# Altium project QUTMS_MCISO-V01.PrjPcb
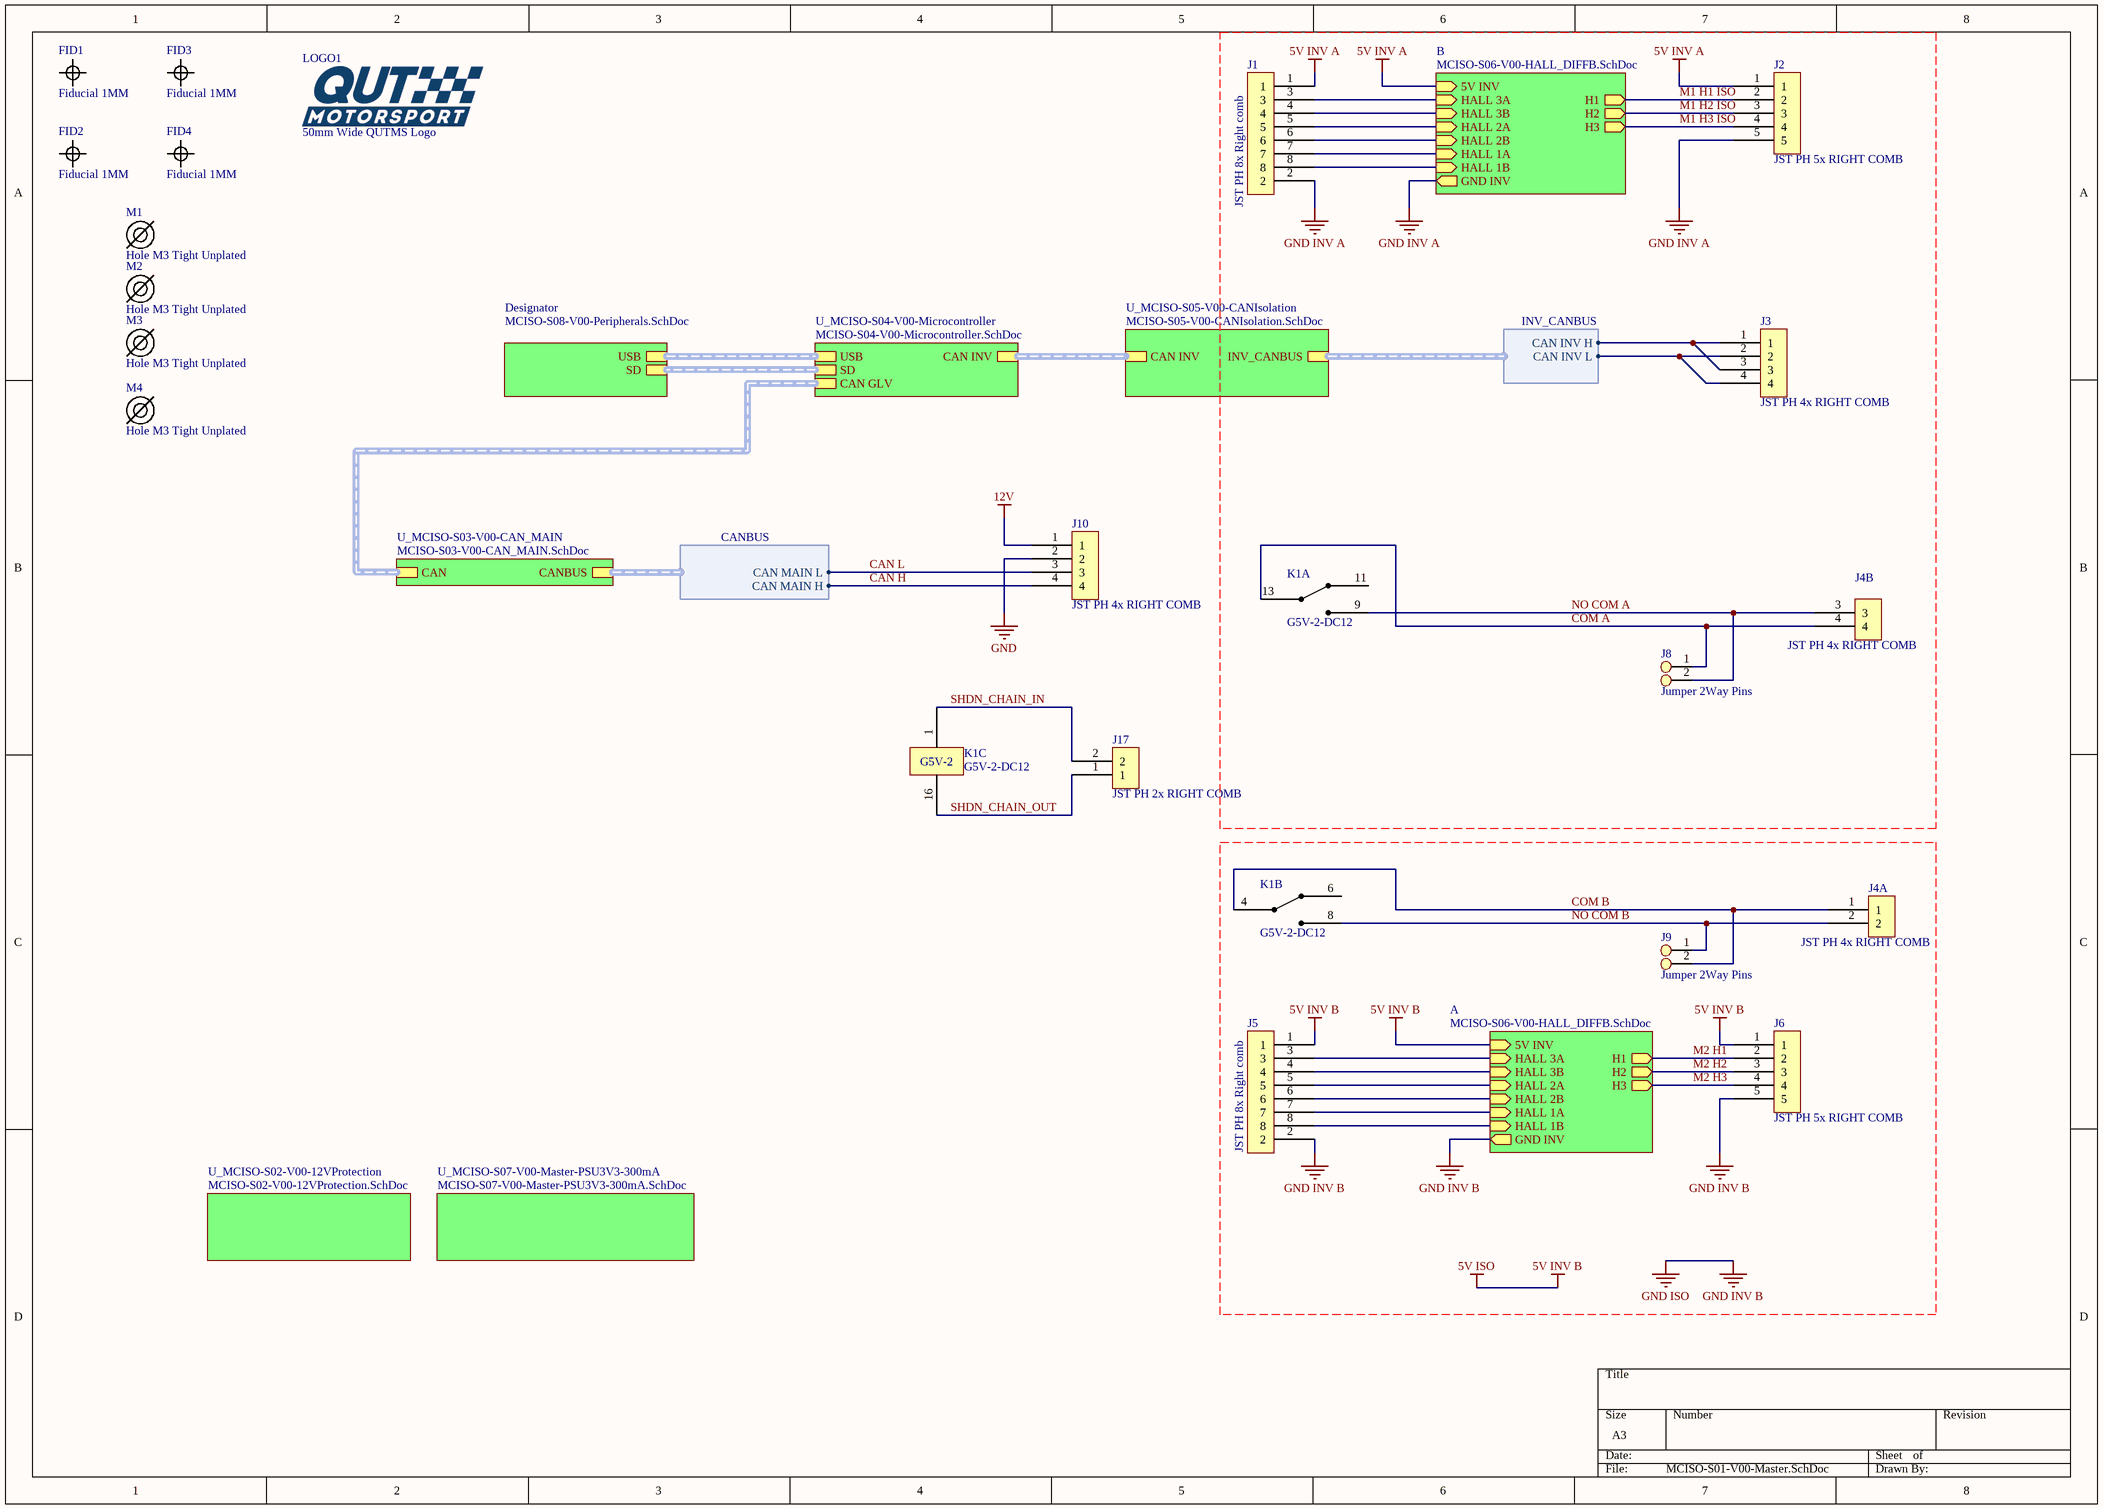
[diagram p0: MCISO-S01-V00-Master.SchDoc]
8 sheets, 124 parts. Net scope: hierarchical (ports join the sheet entries above them; power ports are global).
Board files: MCISO-P01-V05.PcbDoc, MCISO-P01-V06-NewMicro.PcbDoc
Sheets:
  MCISO-S01-V00-Master.SchDoc
    U_MCISO-S04-V00-Microcontroller = MCISO-S04-V00-Microcontroller.SchDoc
    U_MCISO-S05-V00-CANIsolation = MCISO-S05-V00-CANIsolation.SchDoc
    U_MCISO-S02-V00-12VProtection = MCISO-S02-V00-12VProtection.SchDoc
    U_MCISO-S07-V00-Master-PSU3V3-300mA = MCISO-S07-V00-Master-PSU3V3-300mA.SchDoc
    A = MCISO-S06-V00-HALL_DIFFB.SchDoc
    B = MCISO-S06-V00-HALL_DIFFB.SchDoc
    Designator = MCISO-S08-V00-Peripherals.SchDoc
    U_MCISO-S03-V00-CAN_MAIN = MCISO-S03-V00-CAN_MAIN.SchDoc

## Sheet MCISO-S01-V00-Master.SchDoc
size A3; SheetNumber: 1; SheetTotal: 8

### Parts
FID1  Fiducial 1MM  [FIDUCIAL 1MM]  (no BOM)
FID2  Fiducial 1MM  [FIDUCIAL 1MM]  (no BOM)
FID3  Fiducial 1MM  [FIDUCIAL 1MM]  (no BOM)
FID4  Fiducial 1MM  [FIDUCIAL 1MM]  (no BOM)
J1  JST PH 8x Right comb  [JST PH 8x RIGHT SMD]
J2  JST PH 5x RIGHT COMB  [JST PH 5x RIGHT COMB]
J3  JST PH 4x RIGHT COMB  [JST PH 4x RIGHT COMB]
J4  JST PH 4x RIGHT COMB  [JST PH 4x RIGHT COMB]  (parts A,B of 2)
J5  JST PH 8x Right comb  [JST PH 8x RIGHT SMD]
J6  JST PH 5x RIGHT COMB  [JST PH 5x RIGHT COMB]
J8  Jumper 2Way Pins  [Jumper_2Way_Pin]
J9  Jumper 2Way Pins  [Jumper_2Way_Pin]
J10  JST PH 4x RIGHT COMB  [JST PH 4x RIGHT COMB]
J17  JST PH 2x RIGHT COMB  [JST PH 2x RIGHT COMB]
K1  G5V-2-DC12  [G5V-2]  (parts A,B,C of 3)
LOGO1  50mm Wide QUTMS Logo  [QUTMS LOGO 10MM]  (no BOM)
M1  Hole M3 Tight Unplated  [M3.2 UNPLATED]
M2  Hole M3 Tight Unplated  [M3.2 UNPLATED]
M3  Hole M3 Tight Unplated  [M3.2 UNPLATED]
M4  Hole M3 Tight Unplated  [M3.2 UNPLATED]

### Sub-sheets
A = MCISO-S06-V00-HALL_DIFFB.SchDoc: H1 (out), H2 (out), H3 (out), HALL 1A (in), HALL 1B (in), HALL 2A (in), HALL 2B (in), HALL 3A (in), HALL 3B (in), 5V INV (in), GND INV (out)
B = MCISO-S06-V00-HALL_DIFFB.SchDoc: H1 (out), H2 (out), H3 (out), HALL 1A (in), HALL 1B (in), HALL 2A (in), HALL 2B (in), HALL 3A (in), HALL 3B (in), 5V INV (in), GND INV (out)
Designator = MCISO-S08-V00-Peripherals.SchDoc: USB (harness USB), SD (harness SD)
U_MCISO-S02-V00-12VProtection = MCISO-S02-V00-12VProtection.SchDoc: no entries
U_MCISO-S03-V00-CAN_MAIN = MCISO-S03-V00-CAN_MAIN.SchDoc: CANBUS (harness CANBUS), CAN (harness CAN)
U_MCISO-S04-V00-Microcontroller = MCISO-S04-V00-Microcontroller.SchDoc: CAN GLV (harness CAN MAIN), CAN INV (harness CAN INV), USB (harness USB-C), SD (harness SD)
U_MCISO-S05-V00-CANIsolation = MCISO-S05-V00-CANIsolation.SchDoc: INV_CANBUS (harness INV_CANBUS), CAN INV (harness CAN)
U_MCISO-S07-V00-Master-PSU3V3-300mA = MCISO-S07-V00-Master-PSU3V3-300mA.SchDoc: no entries

### Harnesses
INV_CANBUS: CAN INV H, CAN INV L
CANBUS: CAN MAIN H, CAN MAIN L

### Nets
5V INV A: J1.1 J2.1 ; sheet B/5V INV
5V INV B: J5.1 J6.1 ; sheet A/5V INV  [also labelled 5V ISO]
12V: J10.1
GND: J10.2
GND INV A: J1.2 J2.5 ; sheet B/GND INV
GND INV B: J5.2 J6.5 ; sheet A/GND INV  [also labelled GND ISO]
CAN H: J10.4 ; sheet U_MCISO-S03-V00-CAN_MAIN/CANBUS.CAN MAIN H
CAN L: J10.3 ; sheet U_MCISO-S03-V00-CAN_MAIN/CANBUS.CAN MAIN L
COM A: J4.4 J8.1 K1.13
COM B: J4.1 J9.2 K1.4
HALL 1A: J5.7 ; sheet A/HALL 1A
HALL 1A: J1.7 ; sheet B/HALL 1A  [a separate net that carries the same name]
HALL 1B: J5.8 ; sheet A/HALL 1B
HALL 1B: J1.8 ; sheet B/HALL 1B  [a separate net that carries the same name]
HALL 2A: J5.5 ; sheet A/HALL 2A
HALL 2A: J1.5 ; sheet B/HALL 2A  [a separate net that carries the same name]
HALL 2B: J5.6 ; sheet A/HALL 2B
HALL 2B: J1.6 ; sheet B/HALL 2B  [a separate net that carries the same name]
HALL 3A: J5.3 ; sheet A/HALL 3A
HALL 3A: J1.3 ; sheet B/HALL 3A  [a separate net that carries the same name]
HALL 3B: J5.4 ; sheet A/HALL 3B
HALL 3B: J1.4 ; sheet B/HALL 3B  [a separate net that carries the same name]
ISO CAN H: J3.1 J3.3 ; sheet U_MCISO-S05-V00-CANIsolation/INV_CANBUS.CAN INV H
ISO CAN L: J3.2 J3.4 ; sheet U_MCISO-S05-V00-CANIsolation/INV_CANBUS.CAN INV L
M1 H1 ISO: J2.2 ; sheet B/H1  [project net H1]
M1 H2 ISO: J2.3 ; sheet B/H2  [project net H2]
M1 H3 ISO: J2.4 ; sheet B/H3  [project net H3]
M2 H1: J6.2 ; sheet A/H1  [project net H1]
M2 H2: J6.3 ; sheet A/H2  [project net H2]
M2 H3: J6.4 ; sheet A/H3  [project net H3]
NO COM A: J4.3 J8.2 K1.9
NO COM B: J4.2 J9.1 K1.8
SHDN_CHAIN_IN: J17.2 K1.1
SHDN_CHAIN_OUT: J17.1 K1.16

Not connected (* = marked no-connect by the designer): K1 6 11

### Buses and harness runs
harness sheet Designator/SD = sheet U_MCISO-S04-V00-Microcontroller/SD
harness sheet Designator/USB = sheet U_MCISO-S04-V00-Microcontroller/USB
harness sheet U_MCISO-S03-V00-CAN_MAIN/CAN = sheet U_MCISO-S04-V00-Microcontroller/CAN GLV
harness sheet U_MCISO-S04-V00-Microcontroller/CAN INV = sheet U_MCISO-S05-V00-CANIsolation/CAN INV

### Notes on the sheet
- (in symbol G5V-2-DC12, part C) G5V-2

### Library data of the parts
J4 = JST PH 4x RIGHT COMB_1
J8 J9 = Jumper 2Way Side Pins
K1 = G5V-2-DC12: General Purpose Relay DPDT (2 Form C) Through Hole, 12V, 2A
LOGO1 = QUTMS Logo 50mm
M1-M4 = Hole M3 Tight Unplated: M3.2 Hole, No Plating

## Sheet MCISO-S04-V00-Microcontroller.SchDoc: MCISO Microcontroller
size A3; DrawnBy: John Hatfield & Bishwam Pattnaik; DocumentNumber: 4; Revision: 01; SheetNumber: 3; SheetTotal: 8; Version: 01; Project: MCISO QEV3; PageSetup: Record=PageOptions|CenterHorizontal=True|CenterVertical=True|PrintScale=0.97|XCorrection=1.00|YCorrection=1.00|PrintKind=0|BorderSize=5000000|LeftOffset=0|BottomOffset=0|Orientation=2|PaperLength=1000|PaperWidth=1000|Scale=100|PaperSource=7|PrintQuality=-4|MediaType=1|DitherType=10|PaperKind=A4|PrintScaleMode=1
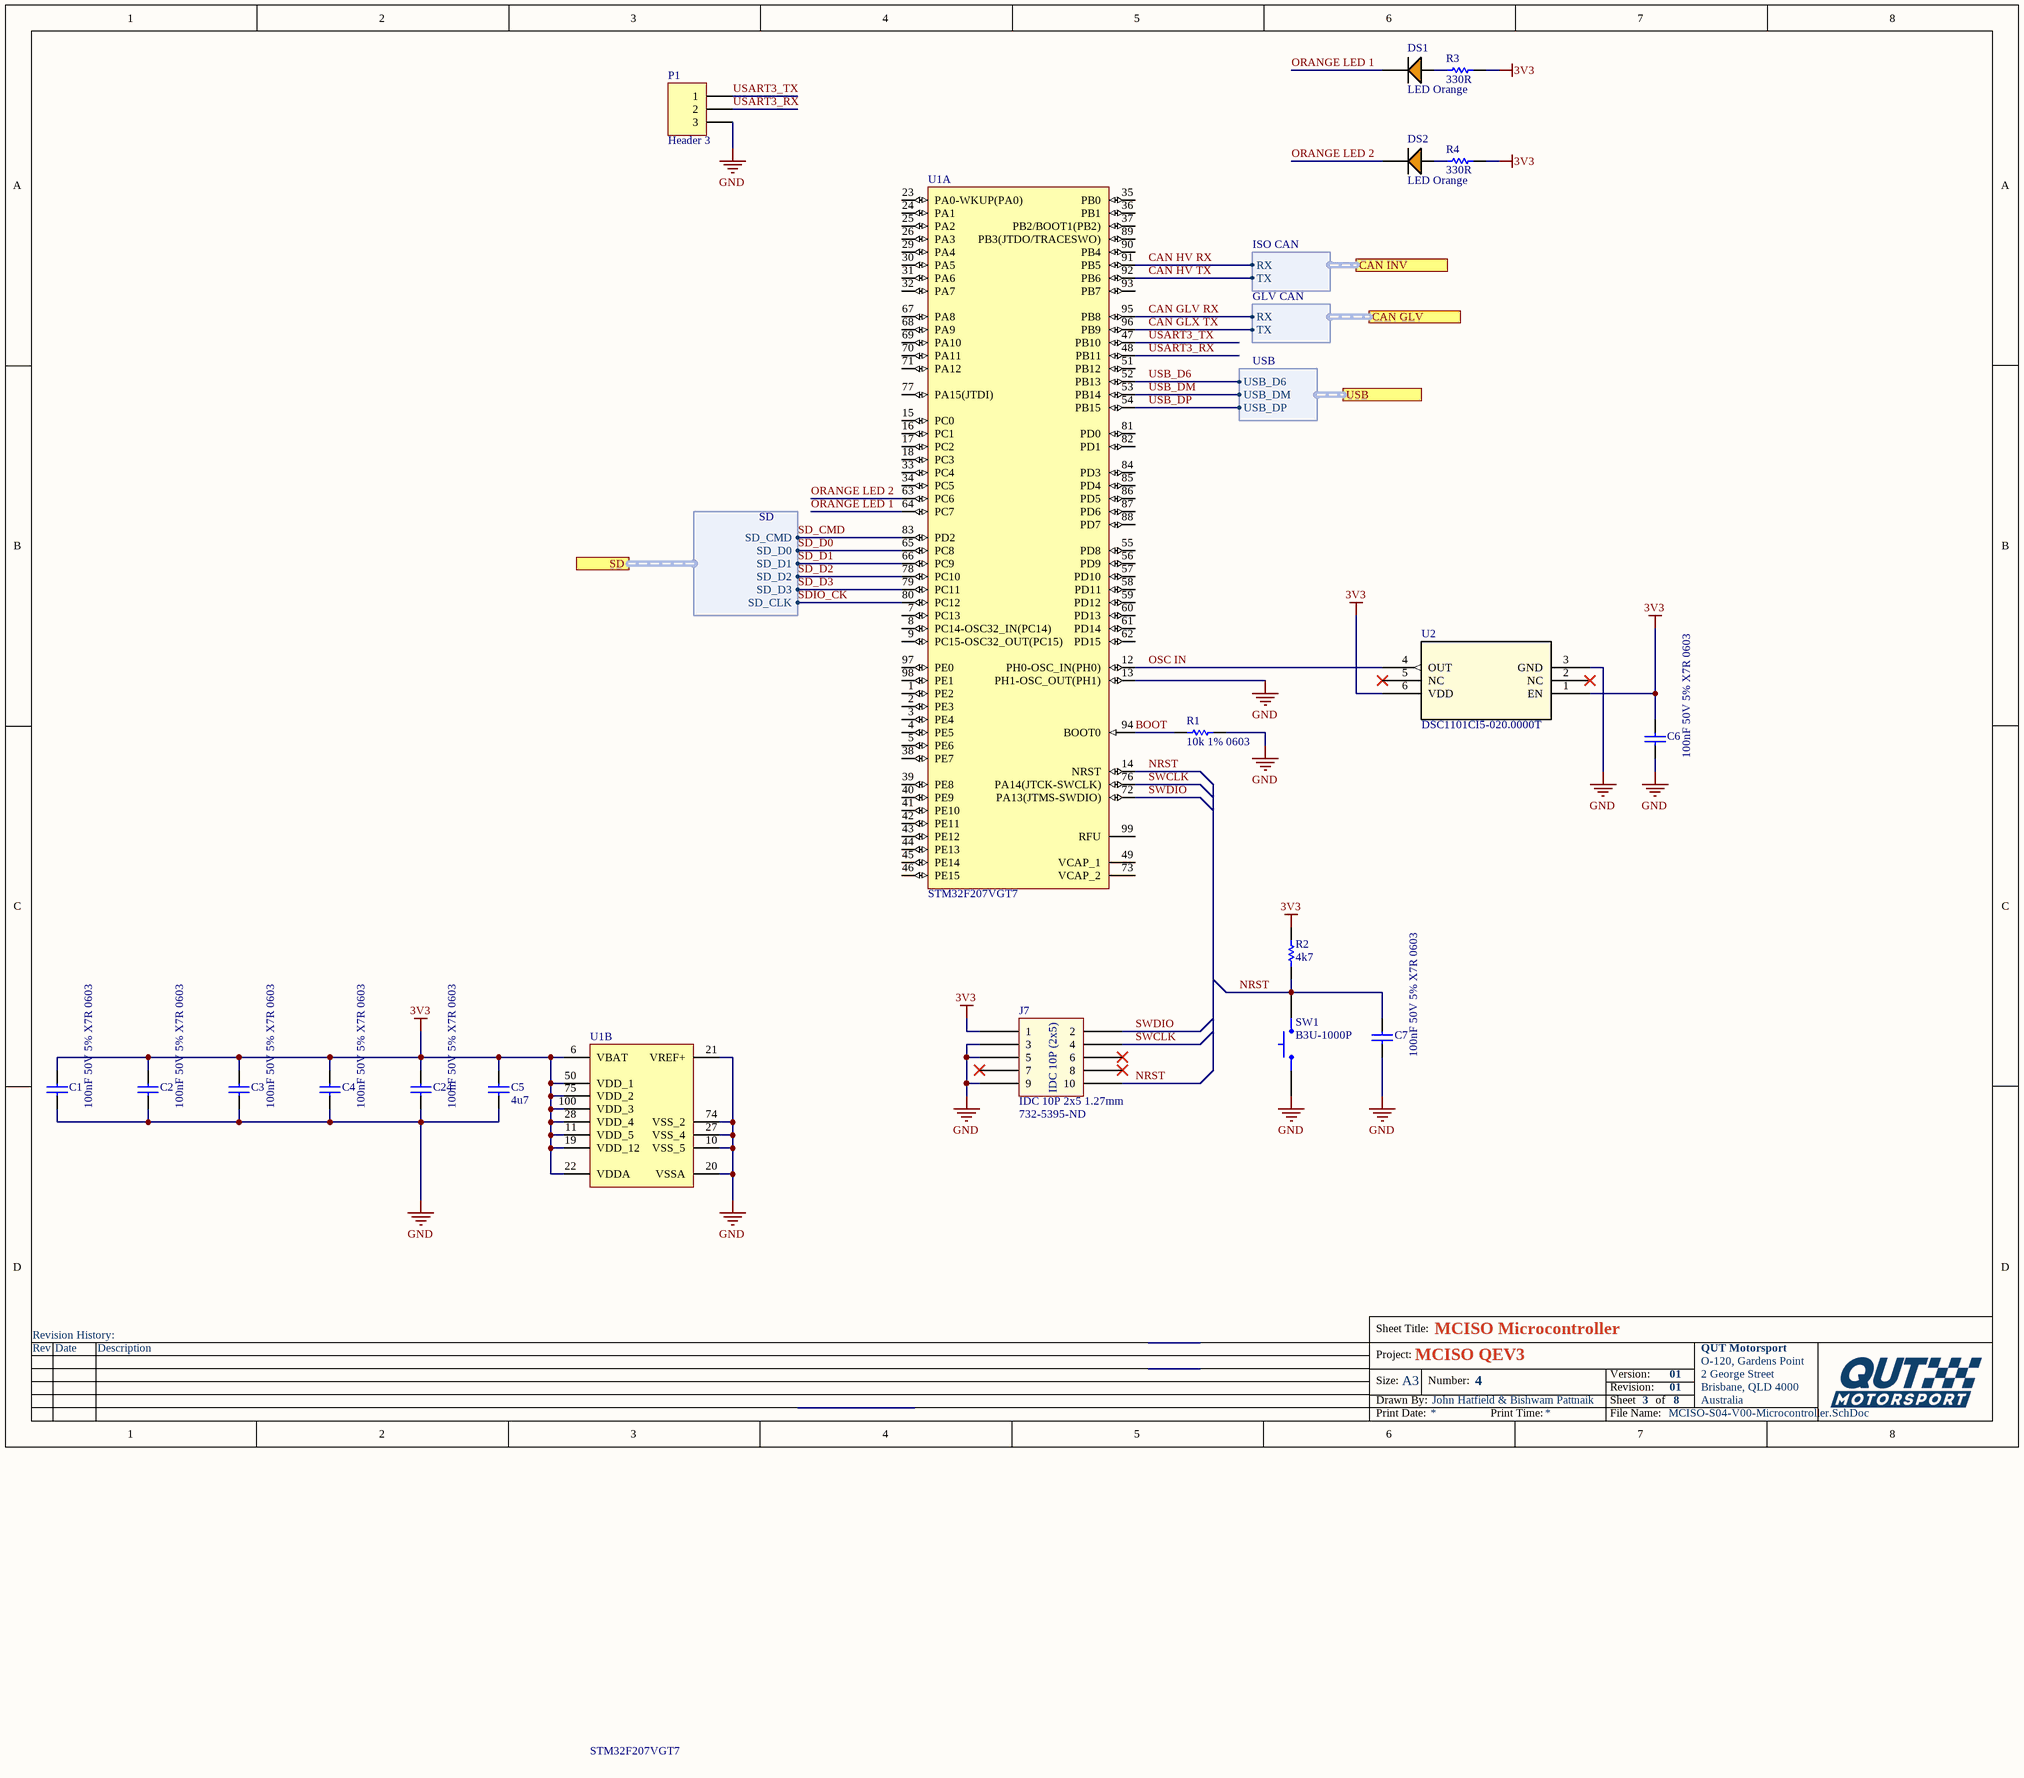
[diagram p1: MCISO-S04-V00-Microcontroller.SchDoc]

### Parts
C1  100nF 50V 5% X7R 0603  [Cap_Ceramic_0603]
C2  100nF 50V 5% X7R 0603  [Cap_Ceramic_0603]
C3  100nF 50V 5% X7R 0603  [Cap_Ceramic_0603]
C4  100nF 50V 5% X7R 0603  [Cap_Ceramic_0603]
C5  4u7  [Cap_Ceramic_0603]
C6  100nF 50V 5% X7R 0603  [Cap_Ceramic_0603]
C7  100nF 50V 5% X7R 0603  [Cap_Ceramic_0603]
C24  100nF 50V 5% X7R 0603  [Cap_Ceramic_0603]
DS1  LED Orange  [LED ORANGE 0603]
DS2  LED Orange  [LED ORANGE 0603]
J7  IDC 10P 2x5 1.27mm  [IDC 1.27MM 10P]
P1  Header 3  [HDR1X3]
R1  10k 1% 0603  [Res_ThinFilm_0603]
R2  4k7  [Res_ThinFilm_0603]
R3  330R  [Res_ThinFilm_0603]
R4  330R  [Res_ThinFilm_0603]
SW1  B3U-1000P  [BTN B3U-1000P]
U1  STM32F207VGT7  [STM-LQFP100_N]  (parts A,B of 2)
U2  DSC1101CI5-020.0000T  [VDFN6_3P2X2P5_MCH]

### Ports
CAN GLV (harness GLV CAN), CAN INV (harness ISO CAN), SD (harness SD), USB (harness USB)

### Harnesses
ISO CAN: TX, RX
GLV CAN: RX, TX
USB: USB_DM, USB_DP, USB_D6
SD: SD_D0, SD_D1, SD_D2, SD_D3, SD_CLK, SD_CMD

### Nets
3V3: C1.2 C2.2 C3.2 C4.2 C5.2 C6.2 C24.2 J7.1 R2.2 R3.2 R4.2 U1.6(VBAT) U1.11(VDD_5) U1.19(VDD_12) U1.22(VDDA) U1.28(VDD_4) U1.50(VDD_1) U1.75(VDD_2) U1.100(VDD_3) U2.1(EN) U2.6(VDD)
GND: C1.1 C2.1 C3.1 C4.1 C5.1 C6.1 C7.1 C24.1 J7.3 J7.5 J7.9 P1.3 R1.2 SW1.1 U1.10(VSS_5) U1.13(PH1-OSC_OUT(PH1)) U1.20(VSSA) U1.21(VREF+) U1.27(VSS_4) U1.74(VSS_2) U2.3(GND)
BOOT: R1.1 U1.94(BOOT0)
CAN GLV RX: U1.95(PB8) ; port CAN GLV.RX
CAN GLX TX: U1.96(PB9) ; port CAN GLV.TX
CAN HV RX: U1.91(PB5) ; port CAN INV.RX
CAN HV TX: U1.92(PB6) ; port CAN INV.TX
NRST: C7.2 J7.10 R2.1 SW1.2 U1.14(NRST)
ORANGE LED 1: DS1.2(C) U1.64(PC7)
ORANGE LED 2: DS2.2(C) U1.63(PC6)
OSC IN: U1.12(PH0-OSC_IN(PH0)) U2.4(OUT)
SD_CMD: U1.83(PD2) ; port SD.SD_CMD
SD_D0: U1.65(PC8) ; port SD.SD_D0
SD_D1: U1.66(PC9) ; port SD.SD_D1
SD_D2: U1.78(PC10) ; port SD.SD_D2
SD_D3: U1.79(PC11) ; port SD.SD_D3
SDIO_CK: U1.80(PC12) ; port SD.SD_CLK
SWCLK: J7.4 U1.76(PA14(JTCK-SWCLK))
SWDIO: J7.2 U1.72(PA13(JTMS-SWDIO))
USART3_RX: P1.2 U1.48(PB11)
USART3_TX: P1.1 U1.47(PB10)
USB_D6: U1.52(PB13) ; port USB.USB_D6
USB_DM: U1.53(PB14) ; port USB.USB_DM  [project net USB DM]
USB_DP: U1.54(PB15) ; port USB.USB_DP  [project net USB DP]
NetDS1_1: DS1.1(A) R3.1
NetDS2_1: DS2.1(A) R4.1

Not connected (* = marked no-connect by the designer): J7 6* 7* 8*; U1 1(PE2) 2(PE3) 3(PE4) 4(PE5) 5(PE6) 7(PC13) 8(PC14-OSC32_IN(PC14)) 9(PC15-OSC32_OUT(PC15)) 15(PC0) 16(PC1) 17(PC2) 18(PC3) 23(PA0-WKUP(PA0)) 24(PA1) 25(PA2) 26(PA3) 29(PA4) 30(PA5) 31(PA6) 32(PA7) 33(PC4) 34(PC5) 35(PB0) 36(PB1) 37(PB2/BOOT1(PB2)) 38(PE7) 39(PE8) 40(PE9) 41(PE10) 42(PE11) 43(PE12) 44(PE13) 45(PE14) 46(PE15) 49(VCAP_1) 51(PB12) 55(PD8) 56(PD9) 57(PD10) 58(PD11) 59(PD12) 60(PD13) 61(PD14) 62(PD15) 67(PA8) 68(PA9) 69(PA10) 70(PA11) 71(PA12) 73(VCAP_2) 77(PA15(JTDI)) 81(PD0) 82(PD1) 84(PD3) 85(PD4) 86(PD5) 87(PD6) 88(PD7) 89(PB3(JTDO/TRACESWO)) 90(PB4) 93(PB7) 97(PE0) 98(PE1) 99(RFU); U2 2(NC)* 5(NC)*

### Notes on the sheet
- (near J7) 732-5395-ND
- Revision History:
- Sheet Title:
- Rev
- Date
- Description
- Project:
- Size:
- Drawn By:
- A3
- Number:
- Revision:
- Sheet
- Version:
- of
- QUT Motorsport
- O-120, Gardens Point
- 2 George Street
- Brisbane, QLD 4000
- Australia
- Print Date:
- Print Time:
- File Name:
- (in symbol IDC 10P 2x5 1.27mm) IDC 10P (2x5)

### Library data of the parts
C1-C4 C6 C7 C24 = 100nF 50V 5% X7R 0603: Capacitor, Ceramic, SMD, 100nF, 50V, 5%, X7R, 0603
C5 = 4u7 50V 5% X7R 0603: Capacitor, Ceramic, SMD, 4u7, 50V, 5%, X7R, 0603
DS1 DS2 = LED ORANGE 0603
P1 = Header 3: Header, 3-Pin; LatestRevisionDate: 17-Jul-2002; LatestRevisionNote: Re-released for DXP Platform.; Publisher: Altium Limited
R1 = 20k 1% 0603: Resistor, SMD, 20k, 0.1W, 5%, 0603
R2 = 4k7 5% 0603: Resistor, SMD, 4k7, 0.1W, 5%, 0603
R3 R4 = 330R 5% 0603: Resistor, SMD, 330R, 0.1W, 5%, 0603
SW1 = BTN B3U-1000P: Omron B3U-1000P Ultra Miniture Switch; ComponentLink1Description: LCSC; ComponentLink1URL: https://lcsc.com/product-detail/Tactile-Switches_BRIGHT-TSA063G50-250_C294565.html
U1 = STM32F207VGT7-Custom: ARM Cortex-M3 32-bit MCU, 1024 KB Flash, 128 KB Internal RAM, 82 I/Os, 100-pin LQFP, -40 to 105 degC, Tray; D/A Converter: 2x12-bit (2 Channel); Internal RAM Size (kB): 128; Supply Voltage(Vcc) min (V): 1.8; I/Os (High Current): 82; Operating Frequency(F) (Processor speed) (MHz): 120; FLASH Size (Prog) (kB): 1024; PartNumber: STM32F207VGT7; DatasheetVersion: Rev. 9; Core: ARM Cortex-M3; ComponentLink3Description: Package Specification; ComponentLink3URL: http://www.st.com/st-web-ui/static/active/en/resource/technical/document/data_brief/DM00071938.pdf; PackageDescription: 100-Pin Low Profile Quad Flat Package, 14 x 14 mm Body, 0.5 mm Pitch; ComponentLink1Description: Manufacturer URL; PackageVersion: Rev. 1, 06/2013; ComponentLink1URL: http://www.st.com/web/en/home.html; PackageReference: LQFP100; ComponentLink2Description: Datasheet; ComponentLink2URL: http://www.st.com/st-web-ui/static/active/en/resource/technical/document/datasheet/CD00237391.pdf; Mounting Technology: Surface Mount; Packing: Tray
U2 = DSC1101CI5-020.0000T: No Description Available; Vendor: Microchip; Built_By: EMA_Jessica; SourceLibrary: Microchip_2019-08-23_23; Manufacturer_Part_Number: DSC1101CI5-020.0000T; Copyright: Copyright (C) 2018 Accelerated Designs. All rights reserved; RefDes: RefDes; Type: DEV

## Sheet MCISO-S05-V00-CANIsolation.SchDoc: Isolated Canbus
size A3; DrawnBy: John Hatfield; SheetNumber: 4; SheetTotal: 8
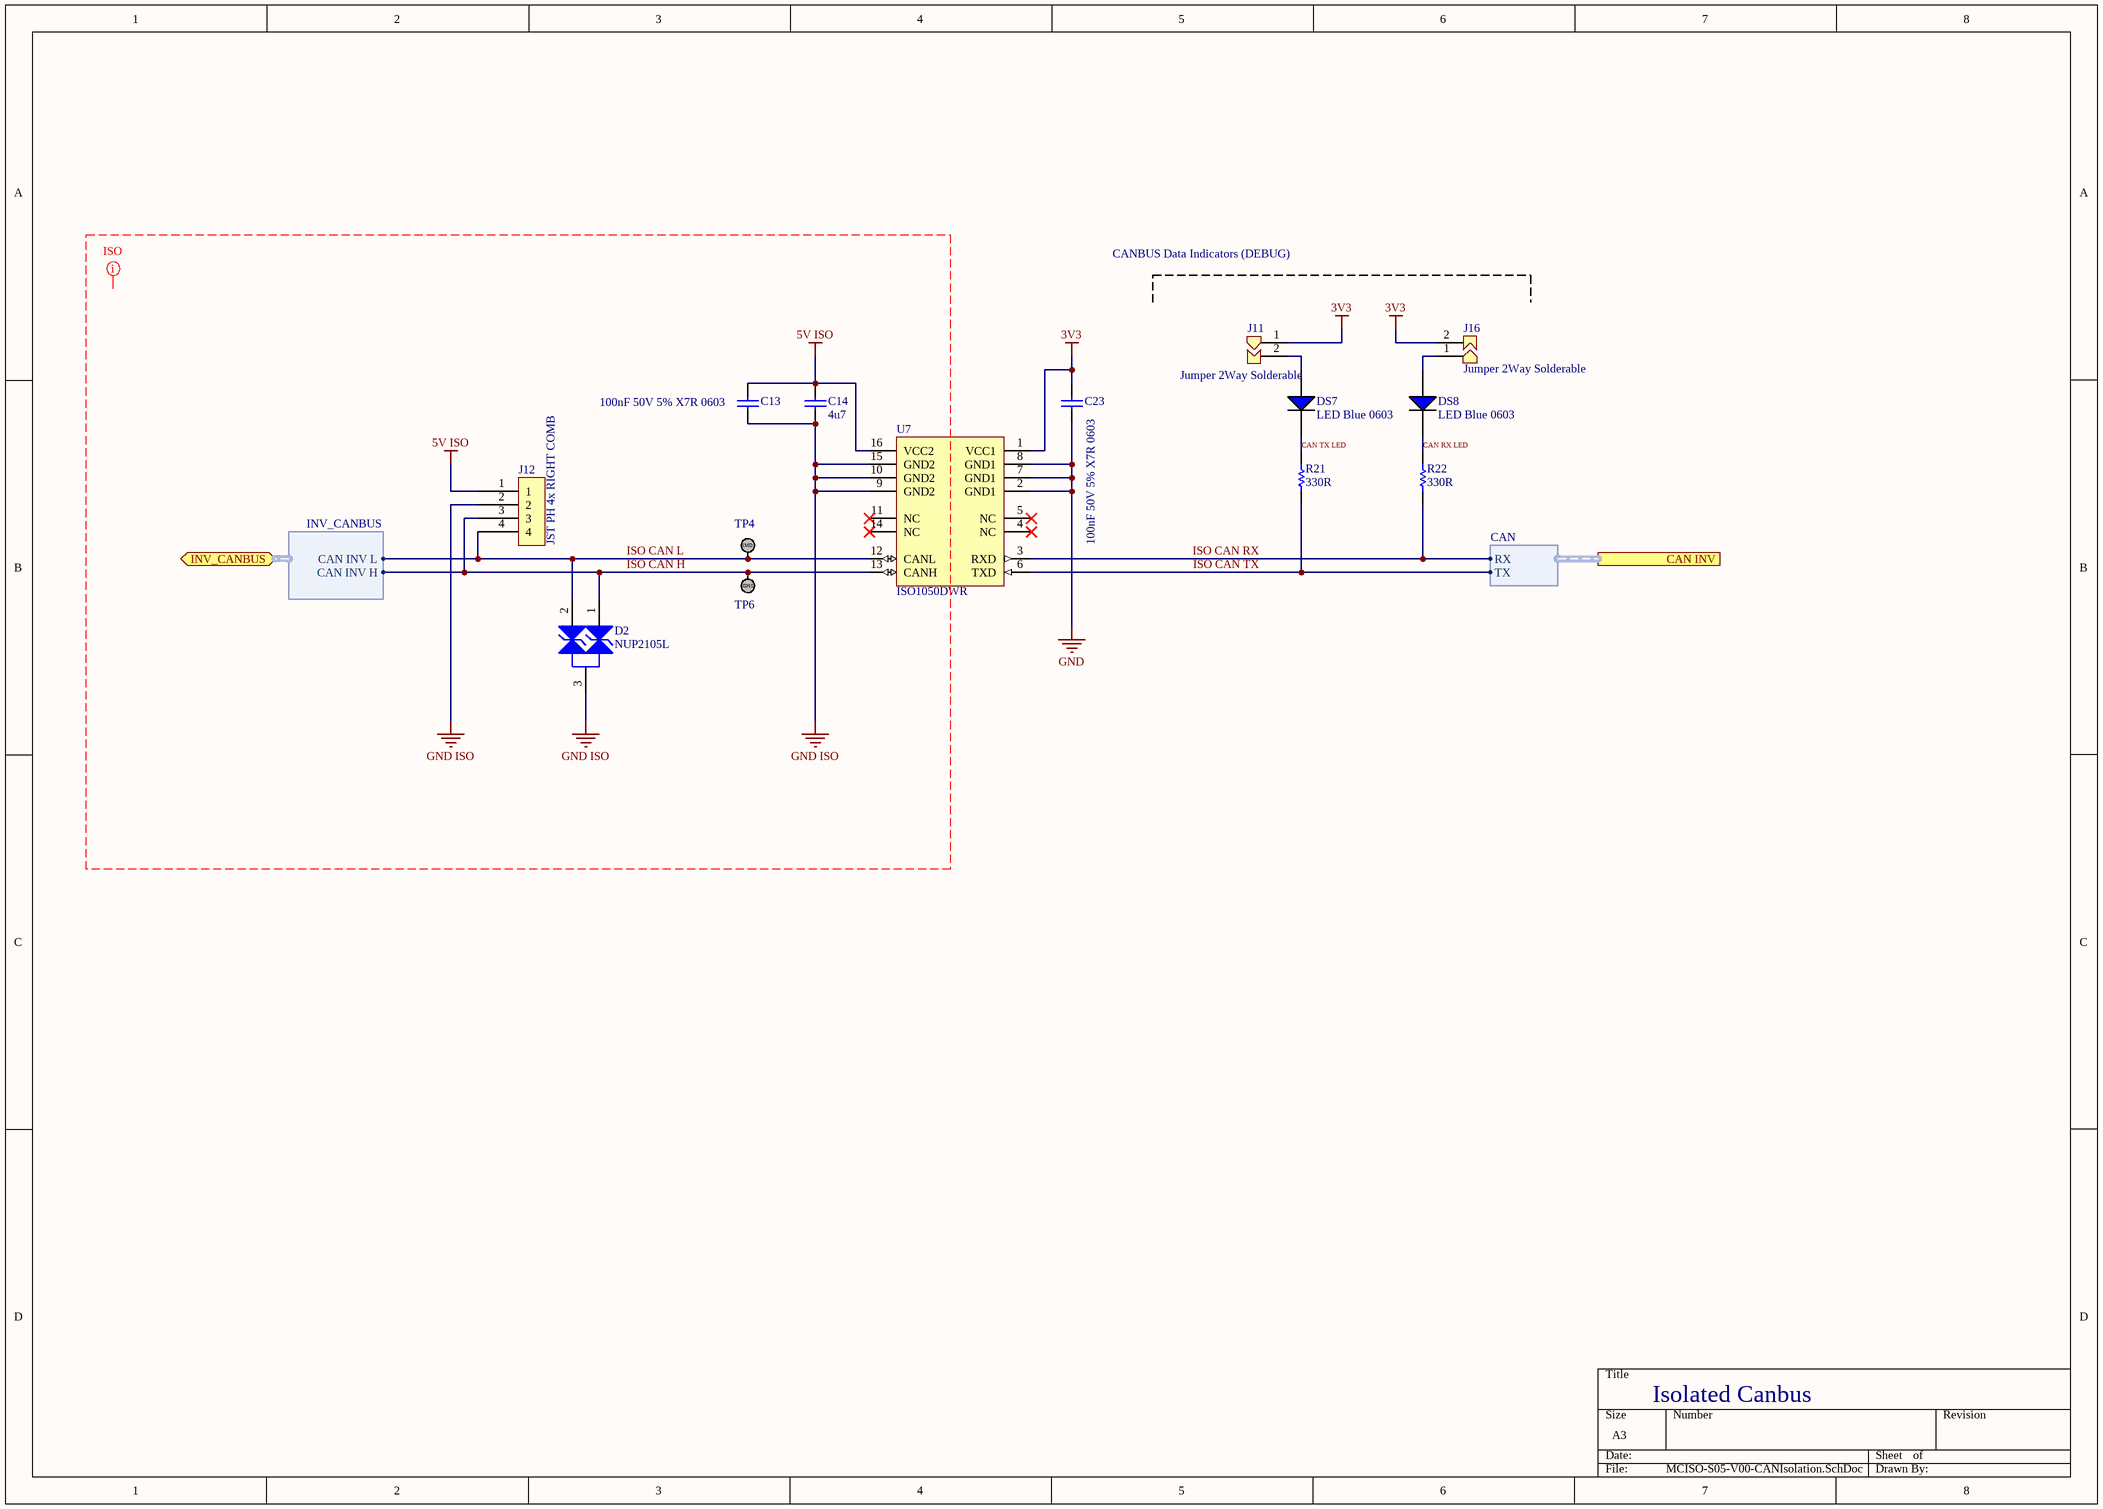
[diagram p2: MCISO-S05-V00-CANIsolation.SchDoc]

### Parts
C13  100nF 50V 5% X7R 0603  [Cap_Ceramic_0603]
C14  4u7  [Cap_Ceramic_0603]
C23  100nF 50V 5% X7R 0603  [Cap_Ceramic_0603]
D2  NUP2105L  [NUP2105L]
DS7  LED Blue 0603  [LED BLUE 0603]
DS8  LED Blue 0603  [LED BLUE 0603]
J11  Jumper 2Way Solderable  [Jumper_2Way_Solderable]
J12  JST PH 4x RIGHT COMB  [JST PH 4x RIGHT COMB]
J16  Jumper 2Way Solderable  [Jumper_2Way_Solderable]
R21  330R  [Res_ThinFilm_0603]
R22  330R  [Res_ThinFilm_0603]
TP4  TestPoint_SMD  [TestPointSMD]  (value not drawn)
TP6  TestPoint_SMD  [TestPointSMD]  (value not drawn)
U7  ISO1050DWR  [DW00016B_V]

### Ports
CAN INV (harness CAN), INV_CANBUS (bidir, harness INV_CANBUS)

### Harnesses
INV_CANBUS: CAN INV L, CAN INV H
CAN: TX, RX

### Nets
3V3: C23.2 J11.1 J16.2 U7.1(VCC1)
5V ISO: C13.2 C14.2 J12.1 U7.16(VCC2)  [project net 5V INV B]
GND: C23.1 U7.2(GND1) U7.7(GND1) U7.8(GND1)
GND ISO: C13.1 C14.1 D2.3 J12.2 U7.9(GND2) U7.10(GND2) U7.15(GND2)  [project net GND INV B]
CAN RX LED: DS8.2(C) R22.2
CAN TX LED: DS7.2(C) R21.2
ISO CAN H: D2.1 J12.3 TP6.1 U7.13(CANH) ; port INV_CANBUS.CAN INV H
ISO CAN L: D2.2 J12.4 TP4.1 U7.12(CANL) ; port INV_CANBUS.CAN INV L
ISO CAN RX: R22.1 U7.3(RXD) ; port CAN INV.RX  [project net CAN HV RX]
ISO CAN TX: R21.1 U7.6(TXD) ; port CAN INV.TX  [project net CAN HV TX]
NetDS7_1: DS7.1(A) J11.2
NetDS8_1: DS8.1(A) J16.1

Not connected (* = marked no-connect by the designer): U7 4(NC)* 5(NC)* 11(NC)* 14(NC)*

### Layout directives
mark named ISO: 5V ISO, GND ISO, ISO CAN H, ISO CAN L

### Notes on the sheet
- CANBUS Data Indicators (DEBUG)
- Isolated Canbus
- (in symbol TestPoint_SMD) SMD

### Library data of the parts
C13 C23 = 100nF 50V 5% X7R 0603: as C1 on sheet MCISO-S04-V00-Microcontroller
C14 = 4u7 50V 5% X7R 0603: as C5 on sheet MCISO-S04-V00-Microcontroller
J11 J16 = Jumper 2Way Side Solderable
J12 = JST PH 4x RIGHT COMB: CAN Ethernet Bridge Port
R21 R22 = 330R 5% 0603: Resistor, SMD, 330R, 0.1W, 5%, 0603
U7 = ISO1050DWR: Isolated CAN Transceiver, -55 to 105 degC, 16-pin SOIC (DW), Green (RoHS & no Sb/Br); Manufacturer: Texas Instruments; Isolated: Yes; Rating: Catalog; Drivers Per Package: 1; ComponentLink1Description: Datasheet; SubFamily: CAN; Mounting Technology: Surface Mount; PackageReference: DW00016B; Code_JEDEC: MS-013-AA; PackageVersion: revG, Jan-2011; ComponentLink2URL: http://www.ti.com/litv/pdf/msoi003g; PartNumber: ISO1050DWR; DatasheetVersion: SLLS983E; Eco-Plan: Green (RoHS & no Sb/Br); ComponentLink1URL: http://www.ti.com/general/docs/lit/getliterature.tsp?genericPartNumber=ISO1050&fileType=pdf; ComponentLink2Description: Package Specification; PackageDescription: 16-Pin Small Outline Integrated Circuit, 10.3 x 7.5 mm, Pitch 1.27 mm Pitch
D2 = NUP2105L: ComponentLink1Description: Datasheet; ComponentLink1URL: https://www.onsemi.cn/PowerSolutions/document/NUP2105L-D.PDF; Parameter 1: *; ComponentLink2Description: LCSC; ComponentLink2URL: https://lcsc.com/product-detail/TVS_ON-Semiconductor-NUP2105LT1G_C14486.html; ComponentLink3Description: Digikey; ComponentLink3URL: https://www.digikey.com.au/product-detail/en/on-semiconductor/SZNUP2105LT1G/SZNUP2105LT1GOSCT-ND/3487669

## Sheet MCISO-S02-V00-12VProtection.SchDoc: 12V Protected Input
size A3; SheetNumber: 2; SheetTotal: 8
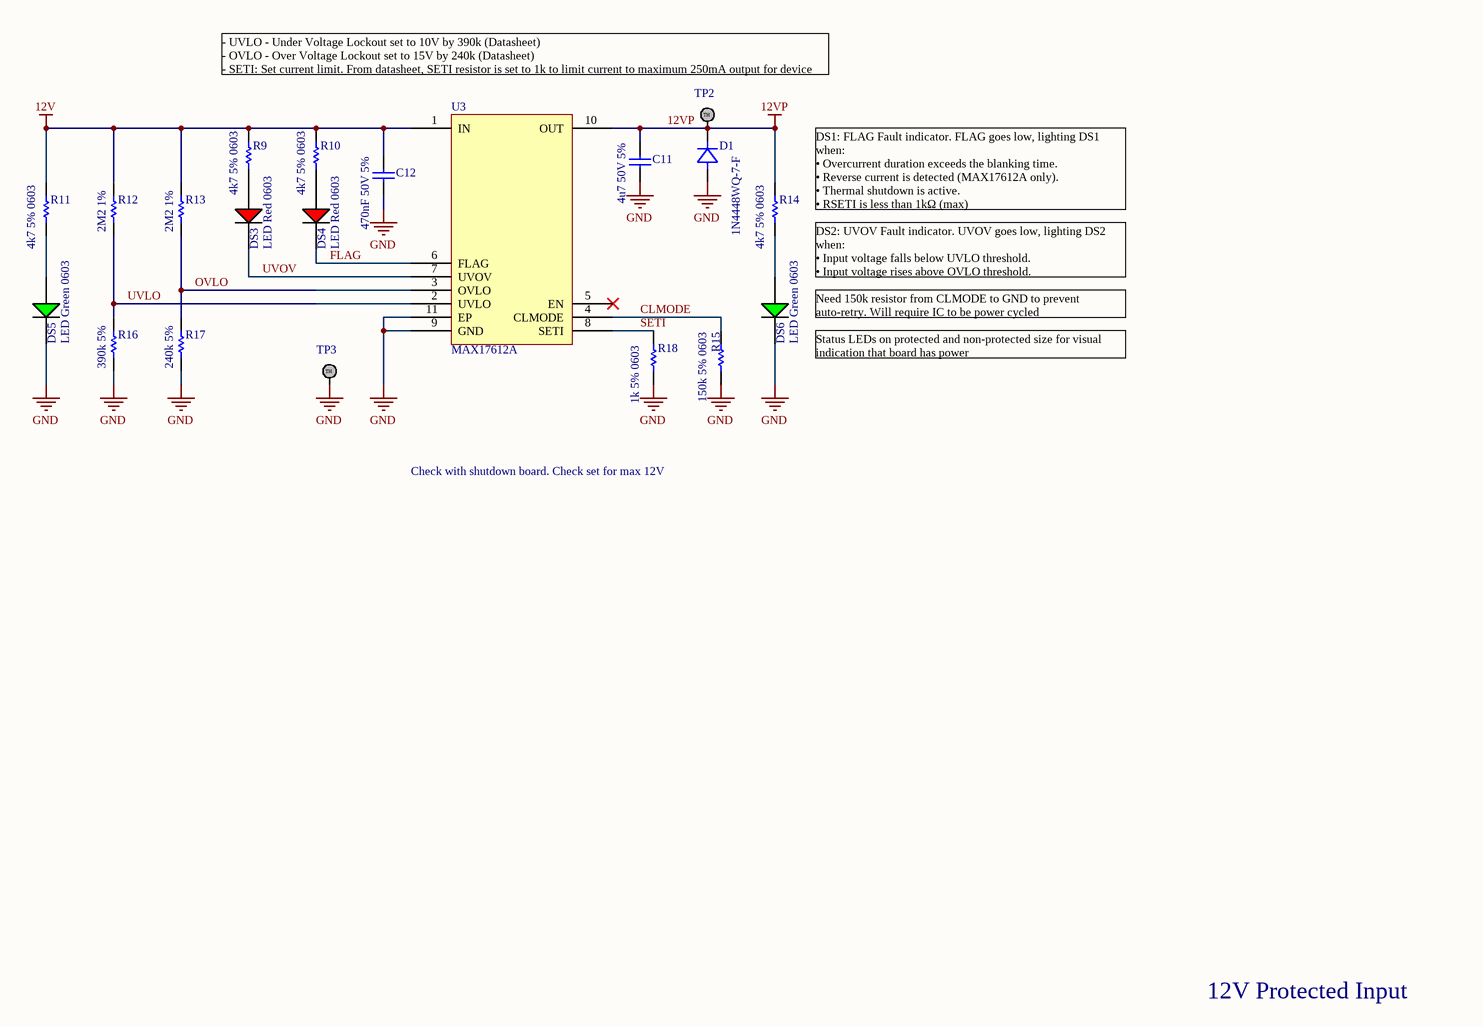
[diagram p3: MCISO-S02-V00-12VProtection.SchDoc]

### Parts
C11  4u7 50V 5%  [Cap_Ceramic_0603]
C12  470nF 50V 5%  [Cap_Ceramic_0603]
D1  1N4448WQ-7-F  [SMA]
DS3  LED Red 0603  [LED RED 0603]
DS4  LED Red 0603  [LED RED 0603]
DS5  LED Green 0603  [LED GREEN 0603]
DS6  LED Green 0603  [LED GREEN 0603]
R9  4k7 5% 0603  [Res_ThinFilm_0603]
R10  4k7 5% 0603  [Res_ThinFilm_0603]
R11  4k7 5% 0603  [Res_ThinFilm_0603]
R12  2M2 1%  [Res_ThinFilm_0603]
R13  2M2 1%  [Res_ThinFilm_0603]
R14  4k7 5% 0603  [Res_ThinFilm_0603]
R15  150k 5% 0603  [Res_ThinFilm_0603]
R16  390k 5%  [Res_ThinFilm_0603]
R17  240k 5%  [Res_ThinFilm_0603]
R18  1k 5% 0603  [Res_ThinFilm_0603]
TP2  TestPoint  [TestPointSMD]  (value not drawn)
TP3  TestPoint  [TestPointSMD]  (value not drawn)
U3  MAX17612A  [MAX17612A]

### Nets
12V: C12.2 R9.2 R10.2 R11.2 R12.2 R13.2 U3.1(IN)
12VP: C11.2 D1.K(Cathode) R14.2 TP2.1 U3.10(OUT)
GND: C11.1 C12.1 D1.A(Anode) DS5.2(C) DS6.2(C) R15.1 R16.1 R17.1 R18.1 TP3.1 U3.9(GND) U3.11(EP)
CLMODE: R15.2 U3.4(CLMODE)
FLAG: DS4.2(C) U3.6(FLAG)
OVLO: R13.1 R17.2 U3.3(OVLO)
SETI: R18.2 U3.8(SETI)
UVLO: R12.1 R16.2 U3.2(UVLO)
UVOV: DS3.2(C) U3.7(UVOV)
NetDS3_1: DS3.1(A) R9.1
NetDS4_1: DS4.1(A) R10.1
NetDS5_1: DS5.1(A) R11.1
NetDS6_1: DS6.1(A) R14.1

Not connected (* = marked no-connect by the designer): U3 5(EN)*

### Notes on the sheet
- - UVLO - Under Voltage Lockout set to 10V by 390k (Datasheet)
  - OVLO - Over Voltage Lockout set to 15V by 240k (Datasheet)
  - SETI: Set current limit. From datasheet, SETI resistor is set to 1k to limit current to maximum 250mA output for device
- (near R14) DS1: FLAG Fault indicator. FLAG goes low, lighting DS1 when:
  • Overcurrent duration exceeds the blanking time.
  • Reverse current is detected (MAX17612A only).
  • Thermal shutdown is active.
  • RSETI is less than 1kΩ (max)
- DS2: UVOV Fault indicator. UVOV goes low, lighting DS2 when:
  • Input voltage falls below UVLO threshold.
  • Input voltage rises above OVLO threshold.
- (near DS6) Need 150k resistor from CLMODE to GND to prevent auto-retry. Will require IC to be power cycled
- (near DS6) Status LEDs on protected and non-protected size for visual indication that board has power
- Check with shutdown board. Check set for max 12V
- 12V Protected Input
- (in symbol TestPoint) TH

### Library data of the parts
C11 = 4u7 50V 5% X7R 0603: as C5 on sheet MCISO-S04-V00-Microcontroller
C12 = 470nF 50V 5% X7R 0603: Capacitor, Ceramic, SMD, 470nF, 50V, 5%, X7R, 0603
D1 = 1N4448WQ-7-F: Diode, SMD, 75V, 5%, 250mA, SOD123; Manufacturer: ON Semiconductor / Fairchild; Manufacturer Part Number: 1N914BWS; Average Rectified Current: 150mA; Element Configuration: Single; Forward Voltage: 1V; Max Reverse Leakage Current: 5uA; Power Dissipation: 200mW; Recovery Time: 4ns; Max Forward Surge Current (Ifsm): 4A; Parameter 1: *; Weight: 0.0276g; Category: Rectifier Diodes; Contact Plating: Tin,Matte; Forward Current: 150mA; Lead Free: Lead Free; Max Operating Temperature: 150°C; Max Repetitive Reverse Voltage (Vrrm): 75V; Max Reverse Voltage (DC): 75V; Min Operating Temperature: -55°C; Mount: Surface Mount; Number of Pins: 2; Package Quantity: 1; Packaging: Tape and Reel; Peak Reverse Current: 5uA; Radiation Hardening: No; REACH SVHC: No SVHC; Reverse Recovery Time: 4ns; Height: 1mm; Length: 1.8mm; Reverse Voltage: 75V; Width: 1.35mm
R9-R11 R14 = 4k7 5% 0603: Resistor, SMD, 4k7, 0.1W, 5%, 0603
R12 R13 = 2M2 1% 0603: Resistor, SMD, 2M2, 0.125W, 1%, 0603
R15 = 150k 5%, 0603: Resistor, SMD, 150k, 0.1W, 5%, 0603
R16 = 390k 5% 0603: Resistor, SMD, 390k, 0.1W, 5%, 0603
R17 = 240k 5% 0603: Resistor, SMD, 240k, 0.1W, 5%, 0603
R18 = 1k 5% 0603: Resistor, SMD, 1k, 0.1W, 5%, 0603
U3 = MAX17612A: 4.5V to 60V, 250mA Current-Limiter with OV, UV, and Reverse Protection; ComponentLink1Description: Datasheet; ComponentLink1URL: https://datasheets.maximintegrated.com/en/ds/MAX17612A-MAX17612C.pdf

## Sheet MCISO-S07-V00-Master-PSU3V3-300mA.SchDoc: Power Supply (20-40V to 3v3 @ 0.1-0.6A)
size A3; DrawnBy: Jonn Dillon; DocumentNumber: 2; Revision: 01; SheetNumber: 5; SheetTotal: 8; Version: 01; Project: AMU 2020 (Sourced from BMS 2020); PageSetup: Record=PageOptions|CenterHorizontal=True|CenterVertical=True|PrintScale=0.97|XCorrection=1.00|YCorrection=1.00|PrintKind=0|BorderSize=5000000|LeftOffset=0|BottomOffset=0|Orientation=2|PaperLength=1000|PaperWidth=1000|Scale=100|PaperSource=7|PrintQuality=-4|MediaType=1|DitherType=10|PaperKind=A4|PrintScaleMode=1
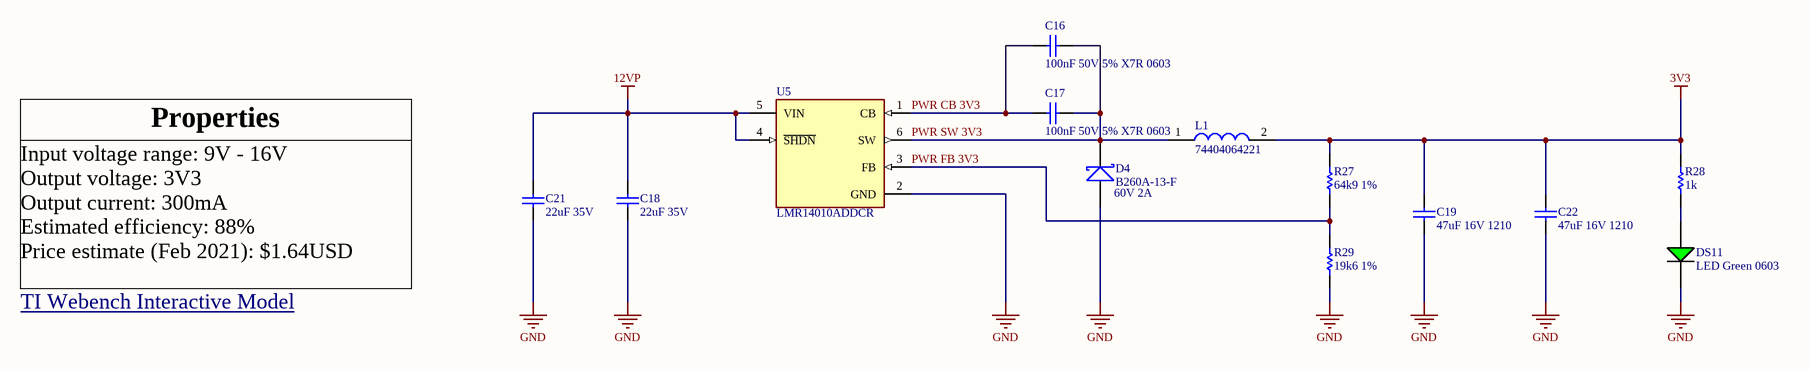
[diagram p4: MCISO-S07-V00-Master-PSU3V3-300mA.SchDoc]

### Parts
C16  100nF 50V 5% X7R 0603  [Cap_Ceramic_0603]
C17  100nF 50V 5% X7R 0603  [Cap_Ceramic_0603]
C18  22uF 35V  [Cap_Ceramic_1206]
C19  47uF 16V 1210  [Cap_Ceramic_1210]
C21  22uF 35V  [Cap_Ceramic_1206]
C22  47uF 16V 1210  [Cap_Ceramic_1210]
D4  B260A-13-F  [SMA]
DS11  LED Green 0603  [LED GREEN 0603]
L1  74404064221  [Inductor_6x6mm]
R27  64k9 1%  [Res_ThinFilm_0603]
R28  1k  [Res_ThinFilm_0603]
R29  19k6 1%  [Res_ThinFilm_0603]
U5  LMR14010ADDCR  [FP-DDC0006A-MFG]

### Nets
3V3: C19.2 C22.2 L1.2 R27.2 R28.2
12VP: C18.1 C21.1 U5.4(~{SHDN}) U5.5(VIN)
GND: C18.2 C19.1 C21.2 C22.1 D4.A DS11.2(C) R29.1 U5.2(GND)
PWR CB 3V3: C16.1 C17.1 U5.1(CB)
PWR FB 3V3: R27.1 R29.2 U5.3(FB)
PWR SW 3V3: C16.2 C17.2 D4.K L1.1 U5.6(SW)
NetDS11_1: DS11.1(A) R28.1

### Notes on the sheet
- Properties
- (near D4) 60V 2A
- Input voltage range: 9V - 16V
  Output voltage: 3V3
  Output current: 300mA
  Estimated efficiency: 88%
  Price estimate (Feb 2021): $1.64USD
- TI Webench Interactive Model <https://webench.ti.com/power-designer/switching-regulator/customize/16?O1I=0.3&O1V=3.3&VinMax=16.0&VinMin=9.0&action=schematic&base_pn=LMR14010A&lang_chosen=en_US&op_TA=30.0&optFactor=3&origin=ODS__LMR14010A>
- Title
- Size:
- Date:
- A3
- Number:
- Time:
- Revision:
- Sheet
- of
- File:

### Library data of the parts
C16 C17 = 100nF 50V 5% X7R 0603: as C1 on sheet MCISO-S04-V00-Microcontroller
C18 C21 = 22uF 35V 20% X5R 1206: 22µF ±20% 35V Ceramic Capacitor X5R 1206 (3216 Metric); ComponentLink1Description: Digikey; ComponentLink1URL: https://www.digikey.com.au/product-detail/en/tdk-corporation/C3216X5R1V226M160AC/445-8045-1-ND/2792165; ComponentLink2Description: Datasheet; ComponentLink2URL: https://product.tdk.com/info/en/catalog/datasheets/mlcc_commercial_general_en.pdf
C19 C22 = 47uF 16V 10% X7R 1210: Capacitor, Ceramic, SMD, 47uF, 16V, 5%, X7R, 1210
D4 = B260A-13-F: Diode, Schottky Barrier Rectifier, 60 V, 2 A, B260A-13-F
L1 = 74404064221: FIXED IND 220UH 660MA 850 MOHM; ComponentLink1Description: Digikey; ComponentLink1URL: https://www.digikey.com.au/product-detail/en/w%C3%BCrth-elektronik/74404064221/732-7261-1-ND/5353241; ComponentLink2Description: LCSC A; ComponentLink2URL: https://lcsc.com/product-detail/Power-Inductors_Sunlord-SWPA6045S221MT_C91047.html; ComponentLink3Description: LCSC B; ComponentLink3URL: https://lcsc.com/product-detail/Power-Inductors_SXN-Shun-Xiang-Nuo-Elec-SMNR6045-221MT_C467145.html
R27 = 64k9 1% 0603: Resistor, SMD, 64k9, 0.1W, 5%, 0603
R28 = 1k 5% 0603: Resistor, SMD, 1k, 0.1W, 5%, 0603
R29 = 19k6 1% 0603: Resistor, SMD, 19k6, 0.1W, 5%, 0603
U5 = CMP-04918-000056-1: IC REG BUCK ADJ 1A TSOT23-6; Manufacturer: Texas Instruments; Max Junction Temp: +125°C; Number Of Outputs: 1; Standoff Height: 0mm; Switching Frequency: 700kHz; Min Supply Voltage: 4V; Max Supply Voltage: 40V; Max Duty Cycle: 96%; Output Type: AdjustableProgrammable; Manufacturer Part Number: LMR14010ADDCR; Temperature: -40°C to +125°C; Output Current: 1A; Category: IC; Temperature Range High: +125°C; Lead Free: Yes; Switching Topology: Buck; Mouser Description: 4-V to 40-V, 1-A Step-Down Converter With High Efficiency Eco-Mode 6-SOT-23-THIN -40 to 125; Device Class L1: Integrated Circuits (ICs); Digikey Description: IC REG BUCK ADJ 1A TSOT23-6; Package: DDC0006A; Ipc Land Pattern Name: SOT95P280X110-6; Device Class L2: Power Management ICs; Temperature Range Low: -40°C; Height: 1.1mm; Device Class L3: Voltage Regulators - Switching; RoHS: TRUE; Automotive: No; Octopart: https://octopart.com/lmr14010addcr-texas+instruments-90753290; ComponentLink2URL: https://www.ti.com/lit/ds/symlink/lmr14010a.pdf; ComponentLink2Description: Datasheet

## Sheet MCISO-S06-V00-HALL_DIFFB.SchDoc
size A4; SheetNumber: 7; SheetTotal: 8
Used 2 times, as channels A, B. Parts and nets are listed once, with the designators drawn on the sheet.
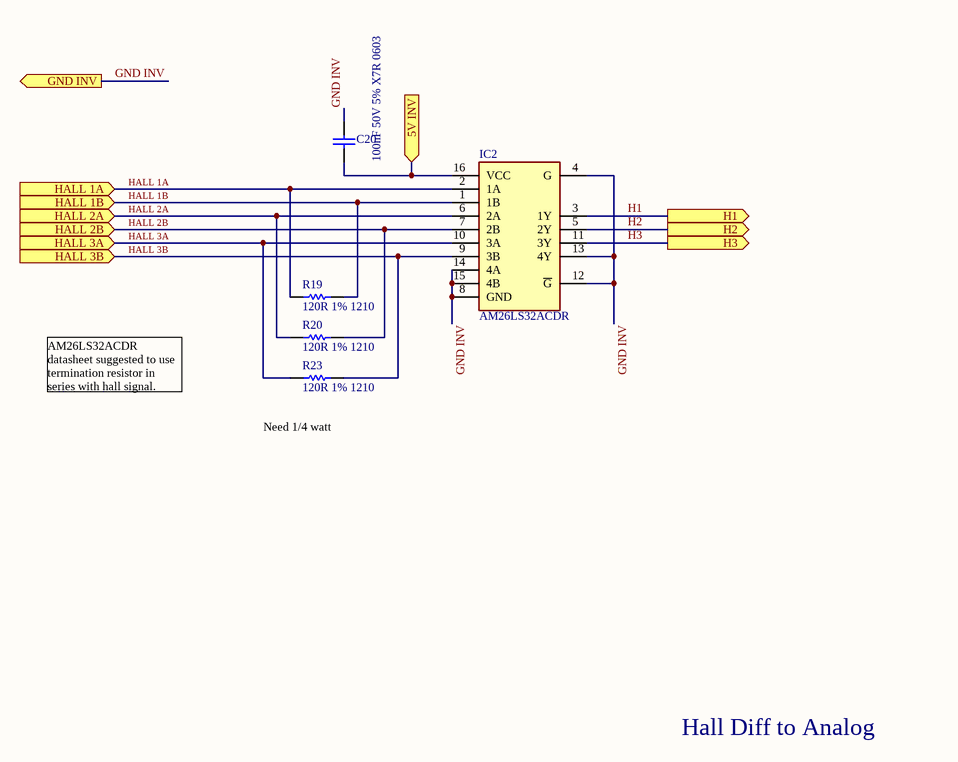
[diagram p5: MCISO-S06-V00-HALL_DIFFB.SchDoc]

### Parts
C20  100nF 50V 5% X7R 0603  [Cap_Ceramic_0603]
IC2  AM26LS32ACDR  [SOIC127P600X175-16N]
R19  120R 1% 1210  [Res_ThinFilm_1210]
R20  120R 1% 1210  [Res_ThinFilm_1210]
R23  120R 1% 1210  [Res_ThinFilm_1210]

### Ports
5V INV (in), GND INV (out), H1 (out), H2 (out), H3 (out), HALL 1A (in), HALL 1B (in), HALL 2A (in), HALL 2B (in), HALL 3A (in), HALL 3B (in)

### Nets
5V INV: C20.1 IC2.16(VCC) ; port 5V INV
GND INV: C20.2 IC2.4(G) IC2.8(GND) IC2.12(~{G}) IC2.13(4Y) IC2.14(4A) IC2.15(4B) ; port GND INV
H1: IC2.3(1Y) ; port H1
H2: IC2.5(2Y) ; port H2
H3: IC2.11(3Y) ; port H3
HALL 1A: IC2.2(1A) R19.1 ; port HALL 1A
HALL 1B: IC2.1(1B) R19.2 ; port HALL 1B
HALL 2A: IC2.6(2A) R20.1 ; port HALL 2A
HALL 2B: IC2.7(2B) R20.2 ; port HALL 2B
HALL 3A: IC2.10(3A) R23.1 ; port HALL 3A
HALL 3B: IC2.9(3B) R23.2 ; port HALL 3B

### Channels
A: designators end in _A; ports 5V INV=5V INV B GND INV=GND INV B H1=H1 H2=H2 H3=H3 HALL 1A=HALL 1A HALL 1B=HALL 1B HALL 2A=HALL 2A HALL 2B=HALL 2B HALL 3A=HALL 3A HALL 3B=HALL 3B
B: designators end in _B; ports 5V INV=5V INV A GND INV=GND INV A H1=H1 H2=H2 H3=H3 HALL 1A=HALL 1A HALL 1B=HALL 1B HALL 2A=HALL 2A HALL 2B=HALL 2B HALL 3A=HALL 3A HALL 3B=HALL 3B

### Notes on the sheet
- AM26LS32ACDR datasheet suggested to use termination resistor in series with hall signal.
- (near R23) Need 1/4 watt
- Hall Diff to Analog

### Library data of the parts
C20 = 100nF 50V 5% X7R 0603: as C1 on sheet MCISO-S04-V00-Microcontroller
IC2 = AM26LS32ACDR: Integrated Circuit; Manufacturer_Name: Texas Instruments; Datasheet Link: http://www.ti.com/lit/gpn/am26ls32ac; Height: 1.75mm; Manufacturer_Part_Number: AM26LS32ACDR; Mouser Part Number: 595-AM26LS32ACDR; Mouser Price/Stock: https://www.mouser.co.uk/ProductDetail/Texas-Instruments/AM26LS32ACDR/?qs=L4Mc90zKIpjEhSPPcfdoEw%3D%3D; Arrow Part Number: AM26LS32ACDR; Arrow Price/Stock: https://www.arrow.com/en/products/am26ls32acdr/texas-instruments
R19 R20 R23 = 120R 1% 1210: Resistor, SMD, 120R, 0.25W, 1%, 1210

## Sheet MCISO-S08-V00-Peripherals.SchDoc: Peripherals
size A3; DrawnBy: John Hatfield; SheetNumber: 8; SheetTotal: 8
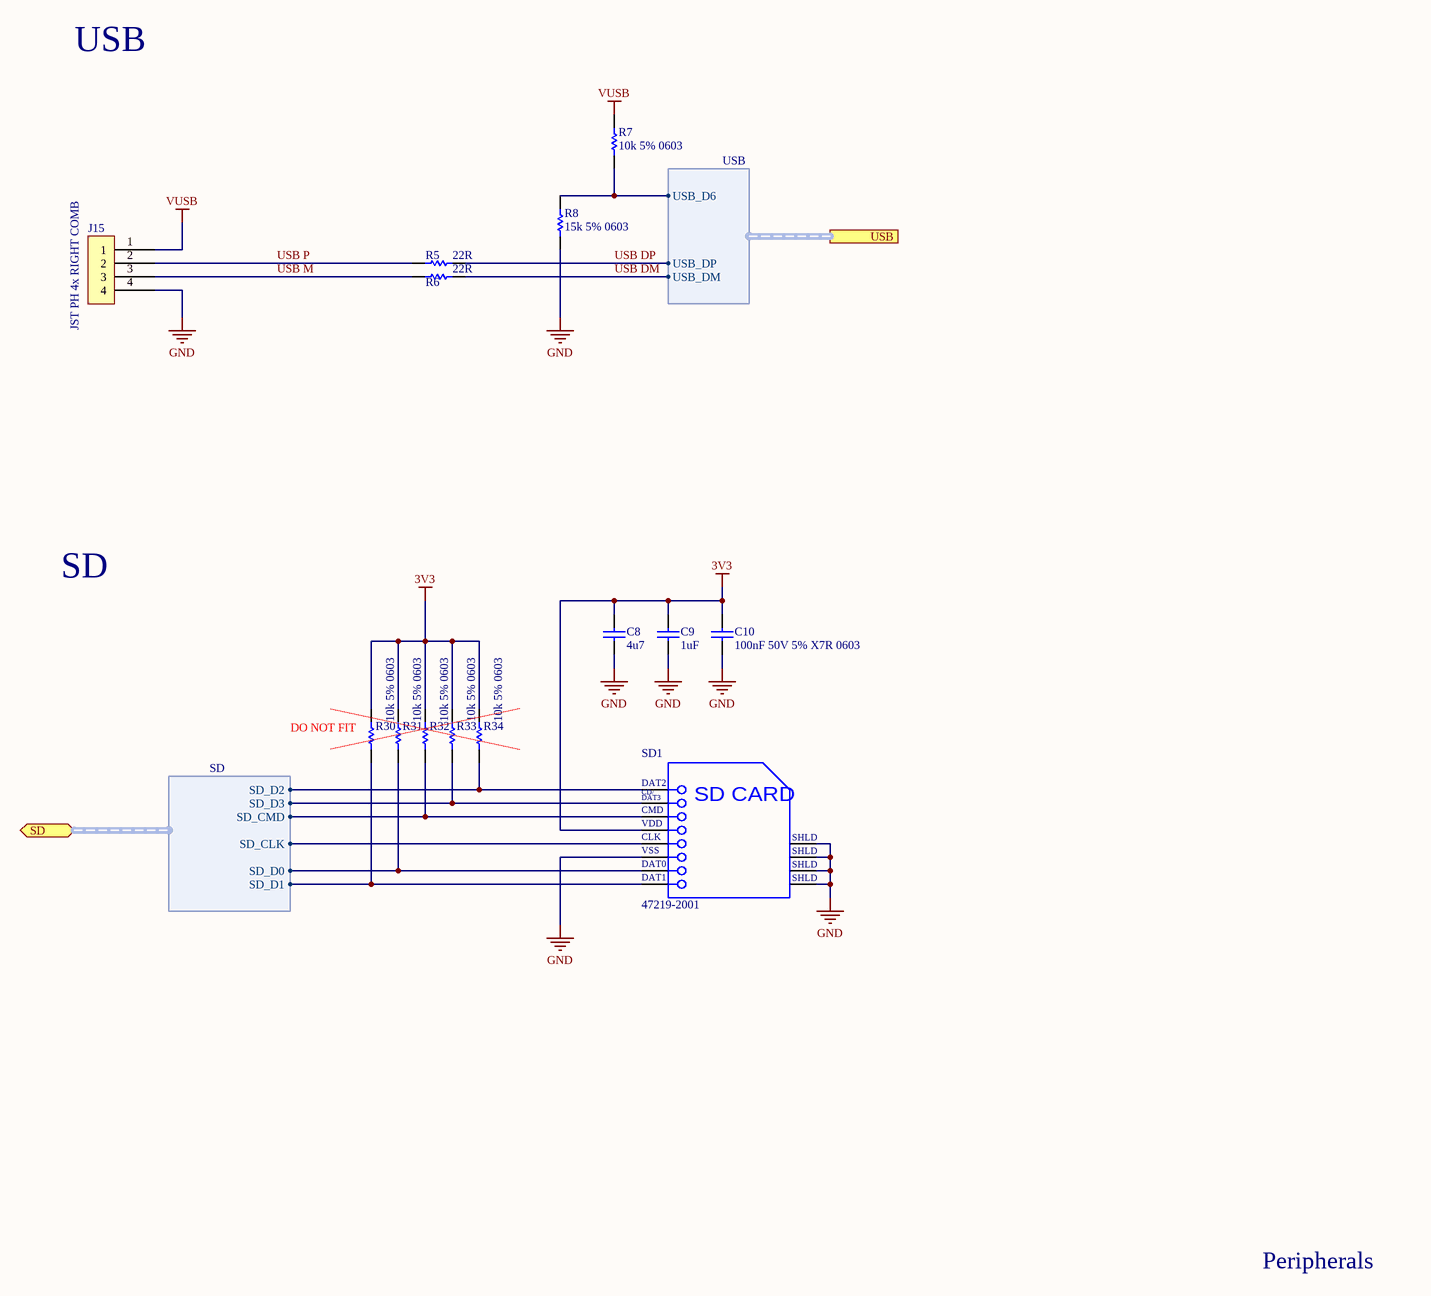
[diagram p6: MCISO-S08-V00-Peripherals.SchDoc]

### Parts
C8  4u7  [Cap_Ceramic_0603]
C9  1uF  [Cap_Ceramic_0603]
C10  100nF 50V 5% X7R 0603  [Cap_Ceramic_0603]
J15  JST PH 4x RIGHT COMB  [JST PH 4x RIGHT COMB]
R5  22R  [Res_ThinFilm_0603]
R6  22R  [Res_ThinFilm_0603]
R7  10k 5% 0603  [Res_ThinFilm_0603]
R8  15k 5% 0603  [Res_ThinFilm_0603]
R30  10k 5% 0603  [Res_ThinFilm_0603]
R31  10k 5% 0603  [Res_ThinFilm_0603]
R32  10k 5% 0603  [Res_ThinFilm_0603]
R33  10k 5% 0603  [Res_ThinFilm_0603]
R34  10k 5% 0603  [Res_ThinFilm_0603]
SD1  47219-2001  [MOLX-47219-2001-8_V]

### Ports
SD (bidir, harness SD), USB (harness USB)

### Harnesses
USB: USB_DP, USB_D6, USB_DM
SD: SD_D2, SD_D3, SD_CMD, SD_CLK, SD_D0, SD_D1

### Nets
3V3: C8.2 C9.2 C10.2 R30.2 R31.2 R32.2 R33.2 R34.2 SD1.4(VDD)
GND: C8.1 C9.1 C10.1 J15.4 R8.1 SD1.6(VSS) SD1.9(SHLD) SD1.10(SHLD) SD1.11(SHLD) SD1.12(SHLD)
VUSB: J15.1 R7.2
SD_CMD: R32.1 SD1.3(CMD) ; port SD.SD_CMD
SD_D0: R31.1 SD1.7(DAT0) ; port SD.SD_D0
SD_D1: R30.1 SD1.8(DAT1) ; port SD.SD_D1
SD_D2: R34.1 SD1.1(DAT2) ; port SD.SD_D2
SD_D3: R33.1 SD1.2(CD/DAT3) ; port SD.SD_D3
SDIO_CK: SD1.5(CLK) ; port SD.SD_CLK
USB DM: R6.2 ; port USB.USB_DM
USB DP: R5.2 ; port USB.USB_DP
USB M: J15.3 R6.1
USB P: J15.2 R5.1
USB_D6: R7.1 R8.2 ; port USB.USB_D6

### Notes on the sheet
- USB
- SD
- (near R30) DO NOT FIT
- Peripherals
- (in symbol CMP-2000-05245-1) CD/; DAT3; SD CARD

### Library data of the parts
C8 = 4u7 50V 5% X7R 0603: as C5 on sheet MCISO-S04-V00-Microcontroller
C9 = 1uF 25V 5% X7R 0603: Capacitor, Ceramic, SMD, 1uF, 25V, 5%, X7R, 0603
C10 = 100nF 50V 5% X7R 0603: as C1 on sheet MCISO-S04-V00-Microcontroller
R5 R6 = 22R 1% 0603: Resistor, SMD, 22R, 0.1W, 1%, 0603
R7 R30-R34 = 10k 5% 0603: Resistor, SMD, 10k, 0.1W, 5%, 0603
R8 = 15k 5% 0603: Resistor, SMD, 15k, 0.1W, 5%, 0603
SD1 = CMP-2000-05245-1: MicroSD Card Connector, Hinge Type, -40 to 85 degC, 8-Pin SMD, RoHS, Tape and Reel; Manufacturer: Molex; Current Rating: 500mA; Number of Contacts: 8; Pitch: 1.09mm; Insertion - Extraction Style: Hinged; Voltage Rating: 100VDC; Product: CardConnectors; Contact Material: CopperAlloy; Series: 47219; Packaging: Reel; Brand: Molex; Product Category: MemoryCardConnectors; Housing Material: Thermoplastic; Mounting Style: SMD/SMT; Termination Style: SMD; Datasheet Version: Rev. F, 06/2009; Card Type: microSD; Manufacturer URL: http://www.molex.com/; RoHS: Details; Datasheet URL: http://www.molex.com/pdm_docs/sd/472192001_sd.pdf; Factory Pack Quantity: 2400

## Sheet MCISO-S03-V00-CAN_MAIN.SchDoc
size A3; SheetNumber: 6; SheetTotal: 8
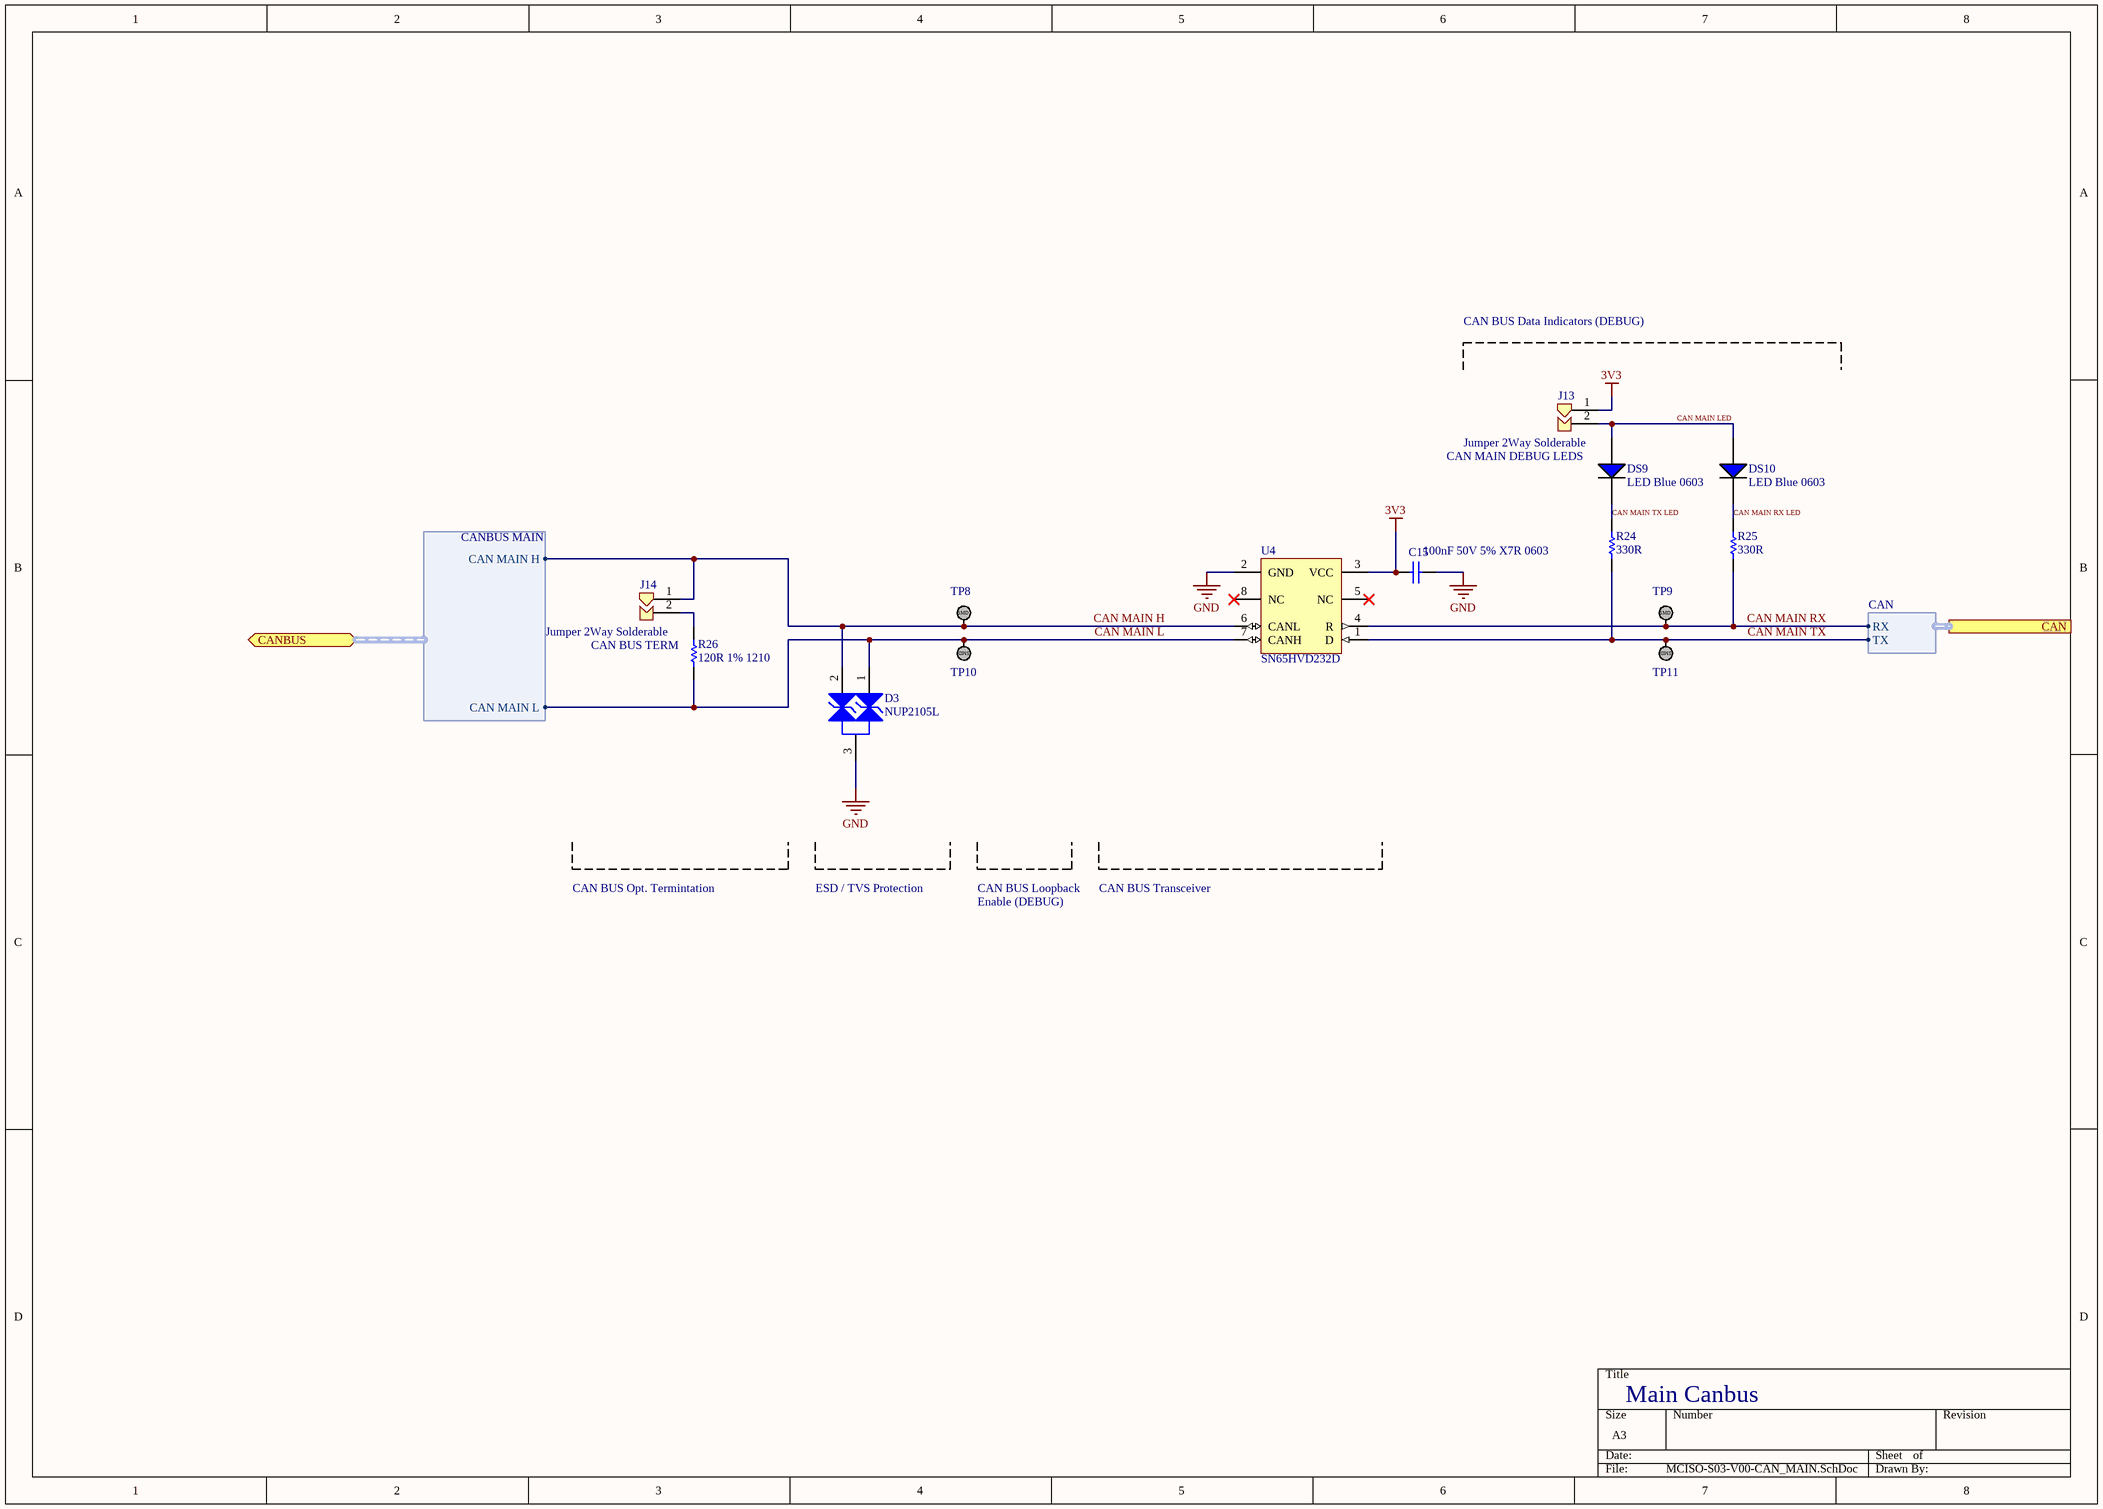
[diagram p7: MCISO-S03-V00-CAN_MAIN.SchDoc]

### Parts
C15  100nF 50V 5% X7R 0603  [Cap_Ceramic_0603]
D3  NUP2105L  [NUP2105L]
DS9  LED Blue 0603  [LED BLUE 0603]
DS10  LED Blue 0603  [LED BLUE 0603]
J13  Jumper 2Way Solderable  [Jumper_2Way_Solderable]
J14  Jumper 2Way Solderable  [Jumper_2Way_Solderable]
R24  330R  [Res_ThinFilm_0603]
R25  330R  [Res_ThinFilm_0603]
R26  120R 1% 1210  [Res_ThinFilm_1210]
TP8  TestPoint_SMD  [TestPointSMD]  (value not drawn)
TP9  TestPoint_SMD  [TestPointSMD]  (value not drawn)
TP10  TestPoint_SMD  [TestPointSMD]  (value not drawn)
TP11  TestPoint_SMD  [TestPointSMD]  (value not drawn)
U4  SN65HVD232D  [D0008A_L]

### Ports
CAN (harness CAN), CANBUS (bidir, harness CANBUS MAIN)

### Harnesses
CANBUS MAIN: CAN MAIN H, CAN MAIN L
CAN: TX, RX

### Nets
3V3: C15.1 J13.1 U4.3(VCC)
GND: C15.2 D3.3 U4.2(GND)
CAN MAIN H: D3.2 J14.1 TP8.1 U4.6(CANL) ; port CANBUS.CAN MAIN H  [project net CAN H]
CAN MAIN L: D3.1 R26.1 TP10.1 U4.7(CANH) ; port CANBUS.CAN MAIN L  [project net CAN L]
CAN MAIN LED: DS9.1(A) DS10.1(A) J13.2
CAN MAIN RX: R25.1 TP9.1 U4.4(R) ; port CAN.RX  [project net CAN GLV RX]
CAN MAIN RX LED: DS10.2(C) R25.2
CAN MAIN TX: R24.1 TP11.1 U4.1(D) ; port CAN.TX  [project net CAN GLX TX]
CAN MAIN TX LED: DS9.2(C) R24.2
NetJ14_2: J14.2 R26.2

Not connected (* = marked no-connect by the designer): U4 5(NC)* 8(NC)*

### Notes on the sheet
- CAN BUS Data Indicators (DEBUG)
- CAN MAIN DEBUG LEDS
- (near R26) CAN BUS TERM
- CAN BUS Opt. Termintation
- ESD / TVS Protection
- CAN BUS Loopback
- Enable (DEBUG)
- CAN BUS Transceiver
- Main Canbus
- (in symbol TestPoint_SMD) SMD

### Library data of the parts
C15 = 100nF 50V 5% X7R 0603: as C1 on sheet MCISO-S04-V00-Microcontroller
J13 J14 = Jumper 2Way Side Solderable
R24 R25 = 330R 5% 0603: Resistor, SMD, 330R, 0.1W, 5%, 0603
R26 = 120R 1% 1210: Resistor, SMD, 120R, 0.25W, 1%, 1210
U4 = CMP-0315-00073-2: 3.3 V CAN Transceiver, 17 mA, -40 to 85 degC, 8-pin SOIC (D), Green (RoHS & no Sb/Br); Manufacturer: Texas Instruments; Supply Voltage(s)(V): 3.3; Transient Pulse Protection(V): -25 to 25; ICC(Max)(mA): 17; Drivers Per Package: 1; Rating: Catalog; Code_JEDEC: MS-012AA; Mounting Technology: Surface Mount; PackageDescription: 8-Pin Plastic Small Outline Integrated Circuit, 4.9 x 3.9 mm, Pitch 1.27 mm Pitch; SubFamily: CAN; PackageVersion: revM, Jun-2011; Isolated: No; DatasheetVersion: SLOS346K; PackageReference: D0008A; Receivers Per Package: 1; Footprint: SN65HVD232; ComponentLink1Description: Datasheet; PartNumber: SN65HVD232D; Eco-Plan: Green (RoHS & no Sb/Br); ComponentLink1URL: http://www.ti.com/general/docs/lit/getliterature.tsp?genericPartNumber=SN65HVD232&fileType=pdf
D3 = NUP2105L: ComponentLink1Description: Datasheet; ComponentLink1URL: https://www.onsemi.cn/PowerSolutions/document/NUP2105L-D.PDF; Parameter 1: *; ComponentLink2Description: LCSC; ComponentLink2URL: https://lcsc.com/product-detail/TVS_ON-Semiconductor-NUP2105LT1G_C14486.html; ComponentLink3Description: Digikey; ComponentLink3URL: https://www.digikey.com.au/product-detail/en/on-semiconductor/SZNUP2105LT1G/SZNUP2105LT1GOSCT-ND/3487669

## Nets that join several sheets
3V3: MCISO-S04-V00-Microcontroller (21 pins), MCISO-S05-V00-CANIsolation (C23.2 J11.1 J16.2 U7.1), MCISO-S07-V00-Master-PSU3V3-300mA (5 pins), MCISO-S08-V00-Peripherals (9 pins), MCISO-S03-V00-CAN_MAIN (C15.1 J13.1 U4.3)
5V INV A: MCISO-S01-V00-Master (J1.1 J2.1), B (C20_B.1 IC2_B.16)
5V INV B: MCISO-S01-V00-Master (J5.1 J6.1), MCISO-S05-V00-CANIsolation (C13.2 C14.2 J12.1 U7.16), A (C20_A.1 IC2_A.16)
12V: MCISO-S01-V00-Master (J10.1), MCISO-S02-V00-12VProtection (7 pins)
12VP: MCISO-S02-V00-12VProtection (5 pins), MCISO-S07-V00-Master-PSU3V3-300mA (C18.1 C21.1 U5.4 U5.5)
GND: MCISO-S01-V00-Master (J10.2), MCISO-S04-V00-Microcontroller (21 pins), MCISO-S05-V00-CANIsolation (C23.1 U7.2 U7.7 U7.8), MCISO-S02-V00-12VProtection (12 pins), MCISO-S07-V00-Master-PSU3V3-300mA (8 pins), MCISO-S08-V00-Peripherals (10 pins), MCISO-S03-V00-CAN_MAIN (C15.2 D3.3 U4.2)
GND INV A: MCISO-S01-V00-Master (J1.2 J2.5), B (7 pins)
GND INV B: MCISO-S01-V00-Master (J5.2 J6.5), MCISO-S05-V00-CANIsolation (7 pins), A (7 pins)
CAN GLV RX: MCISO-S04-V00-Microcontroller (U1.95), MCISO-S03-V00-CAN_MAIN (R25.1 TP9.1 U4.4)
CAN GLX TX: MCISO-S04-V00-Microcontroller (U1.96), MCISO-S03-V00-CAN_MAIN (R24.1 TP11.1 U4.1)
CAN H: MCISO-S01-V00-Master (J10.4), MCISO-S03-V00-CAN_MAIN (D3.2 J14.1 TP8.1 U4.6)
CAN HV RX: MCISO-S04-V00-Microcontroller (U1.91), MCISO-S05-V00-CANIsolation (R22.1 U7.3)
CAN HV TX: MCISO-S04-V00-Microcontroller (U1.92), MCISO-S05-V00-CANIsolation (R21.1 U7.6)
CAN L: MCISO-S01-V00-Master (J10.3), MCISO-S03-V00-CAN_MAIN (D3.1 R26.1 TP10.1 U4.7)
H1: MCISO-S01-V00-Master (J2.2), B (IC2_B.3)
H1: MCISO-S01-V00-Master (J6.2), A (IC2_A.3)
H2: MCISO-S01-V00-Master (J2.3), B (IC2_B.5)
H2: MCISO-S01-V00-Master (J6.3), A (IC2_A.5)
H3: MCISO-S01-V00-Master (J2.4), B (IC2_B.11)
H3: MCISO-S01-V00-Master (J6.4), A (IC2_A.11)
HALL 1A: MCISO-S01-V00-Master (J5.7), A (IC2_A.2 R19_A.1)
HALL 1A: MCISO-S01-V00-Master (J1.7), B (IC2_B.2 R19_B.1)
HALL 1B: MCISO-S01-V00-Master (J5.8), A (IC2_A.1 R19_A.2)
HALL 1B: MCISO-S01-V00-Master (J1.8), B (IC2_B.1 R19_B.2)
HALL 2A: MCISO-S01-V00-Master (J5.5), A (IC2_A.6 R20_A.1)
HALL 2A: MCISO-S01-V00-Master (J1.5), B (IC2_B.6 R20_B.1)
HALL 2B: MCISO-S01-V00-Master (J5.6), A (IC2_A.7 R20_A.2)
HALL 2B: MCISO-S01-V00-Master (J1.6), B (IC2_B.7 R20_B.2)
HALL 3A: MCISO-S01-V00-Master (J5.3), A (IC2_A.10 R23_A.1)
HALL 3A: MCISO-S01-V00-Master (J1.3), B (IC2_B.10 R23_B.1)
HALL 3B: MCISO-S01-V00-Master (J5.4), A (IC2_A.9 R23_A.2)
HALL 3B: MCISO-S01-V00-Master (J1.4), B (IC2_B.9 R23_B.2)
ISO CAN H: MCISO-S01-V00-Master (J3.1 J3.3), MCISO-S05-V00-CANIsolation (D2.1 J12.3 TP6.1 U7.13)
ISO CAN L: MCISO-S01-V00-Master (J3.2 J3.4), MCISO-S05-V00-CANIsolation (D2.2 J12.4 TP4.1 U7.12)
SD_CMD: MCISO-S04-V00-Microcontroller (U1.83), MCISO-S08-V00-Peripherals (R32.1 SD1.3)
SD_D0: MCISO-S04-V00-Microcontroller (U1.65), MCISO-S08-V00-Peripherals (R31.1 SD1.7)
SD_D1: MCISO-S04-V00-Microcontroller (U1.66), MCISO-S08-V00-Peripherals (R30.1 SD1.8)
SD_D2: MCISO-S04-V00-Microcontroller (U1.78), MCISO-S08-V00-Peripherals (R34.1 SD1.1)
SD_D3: MCISO-S04-V00-Microcontroller (U1.79), MCISO-S08-V00-Peripherals (R33.1 SD1.2)
SDIO_CK: MCISO-S04-V00-Microcontroller (U1.80), MCISO-S08-V00-Peripherals (SD1.5)
USB DM: MCISO-S04-V00-Microcontroller (U1.53), MCISO-S08-V00-Peripherals (R6.2)
USB DP: MCISO-S04-V00-Microcontroller (U1.54), MCISO-S08-V00-Peripherals (R5.2)
USB_D6: MCISO-S04-V00-Microcontroller (U1.52), MCISO-S08-V00-Peripherals (R7.1 R8.2)